# EAGLE design base-16-bit (EAGLE 9.4.0)
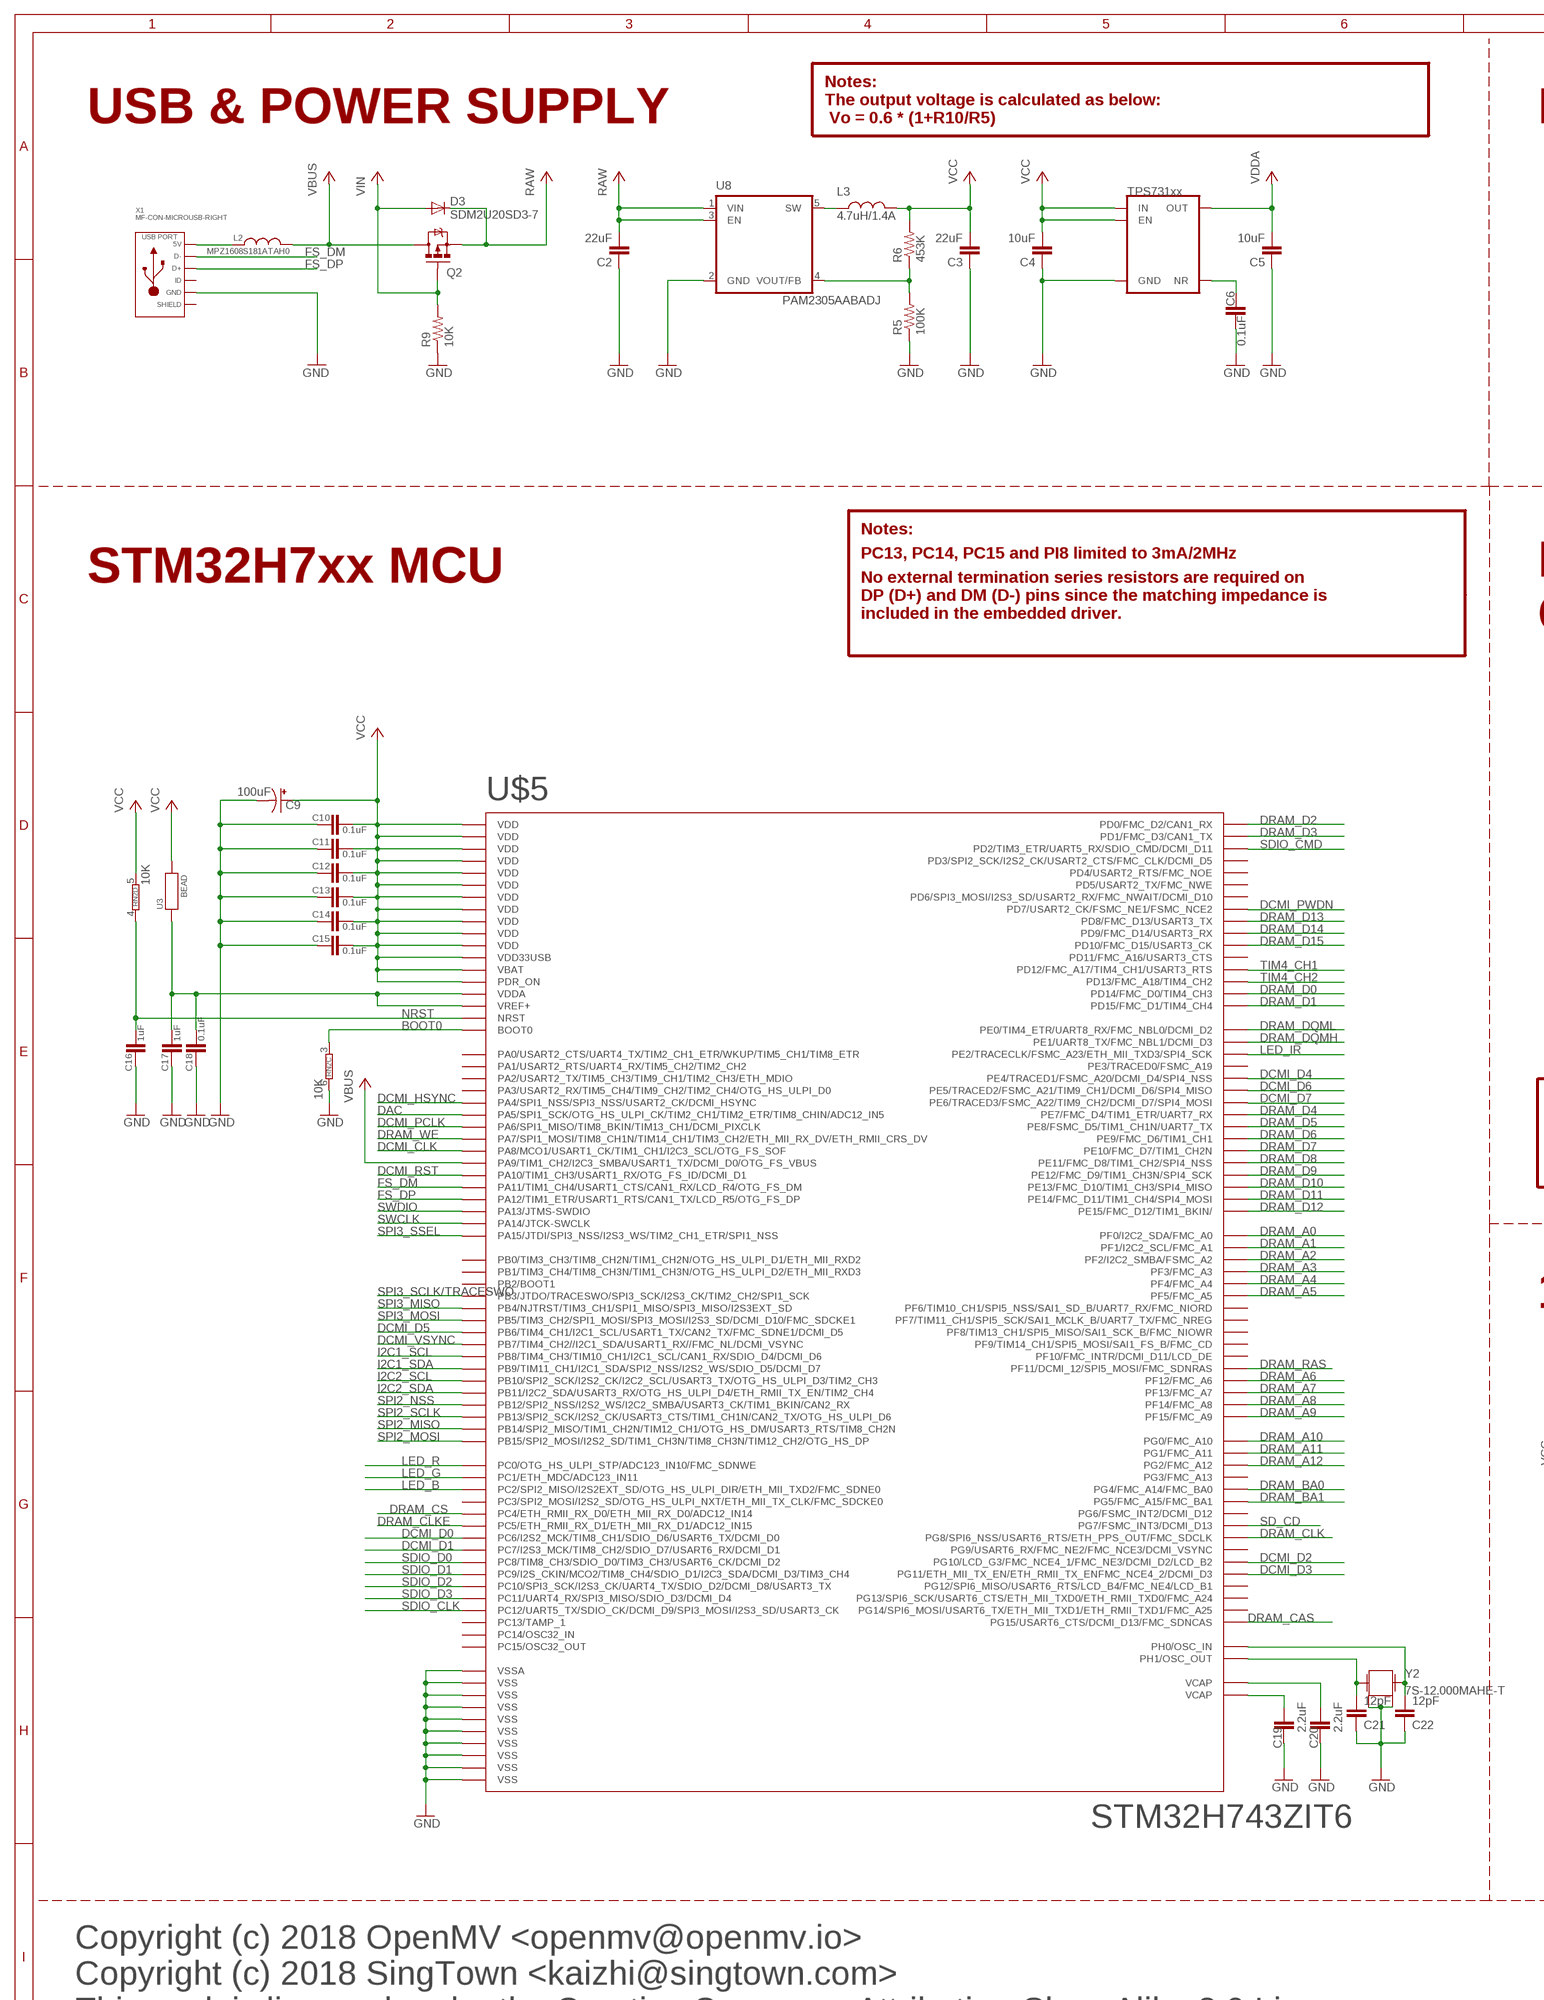
[diagram p0: schematic, sheet 1, part 1 of 2]
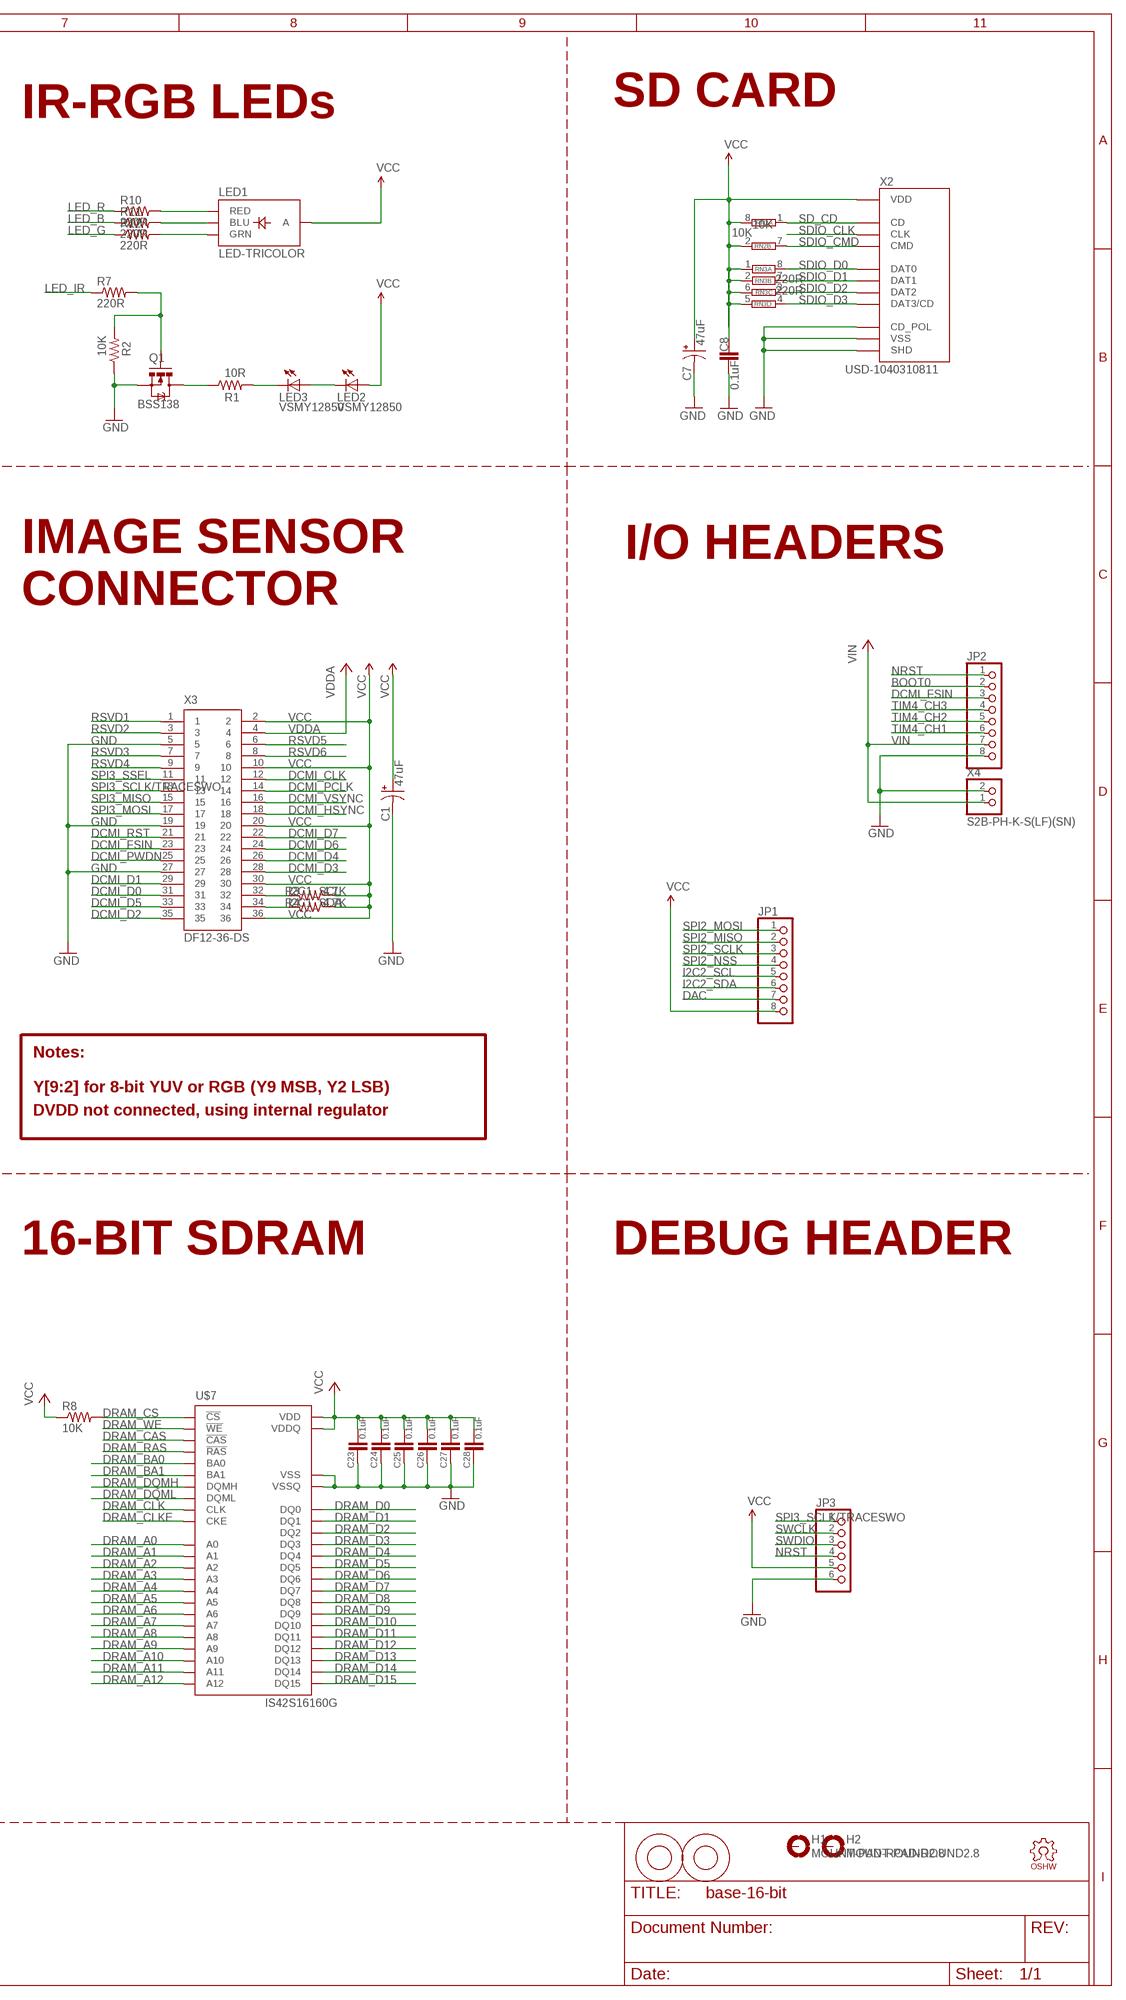
[diagram p1: schematic, sheet 1, part 2 of 2]

## Parts
C1  47uF  CAP_POL1206  [EIA3216]
C2  22uF  CAP0805  [0805]
C3  22uF  CAP0805  [0805]
C4  10uF  CAP0805  [0805]
C5  10uF  CAP0805  [0805]
C6  0.1uF  CAP0603-CAP  [0603-CAP]
C7  47uF  CAP_POL1206  [EIA3216]
C8  0.1uF  CAP0603-CAP  [0603-CAP]
C9  100uF  CAP_POL1206  [EIA3216]
C10  0.1uF  CAP0402-CAP  [0402-CAP]
C11  0.1uF  CAP0402-CAP  [0402-CAP]
C12  0.1uF  CAP0402-CAP  [0402-CAP]
C13  0.1uF  CAP0402-CAP  [0402-CAP]
C14  0.1uF  CAP0402-CAP  [0402-CAP]
C15  0.1uF  CAP0402-CAP  [0402-CAP]
C16  1uF  CAP0603-CAP  [0603-CAP]
C17  1uF  CAP0402-CAP  [0402-CAP]
C18  0.1uF  CAP0402-CAP  [0402-CAP]
C19  2.2uF  CAP0603-CAP  [0603-CAP]
C20  2.2uF  CAP0603-CAP  [0603-CAP]
C21  12pF  CAP0603-CAP  [0603-CAP]
C22  12pF  CAP0603-CAP  [0603-CAP]
C23  0.1uF  CAP0402-CAP  [0402-CAP]
C24  0.1uF  CAP0402-CAP  [0402-CAP]
C25  0.1uF  CAP0402-CAP  [0402-CAP]
C26  0.1uF  CAP0402-CAP  [0402-CAP]
C27  0.1uF  CAP0402-CAP  [0402-CAP]
C28  0.1uF  CAP0402-CAP  [0402-CAP]
D3  SDM2U20SD3-7  DIODESOD  [SOD-323]
H1  MOUNT-PAD-ROUND2.8  [2,8-PAD]
H2  MOUNT-PAD-ROUND2.8  [2,8-PAD]
JP1  PINHD-1X8  [1X08]
JP2  PINHD-1X8  [1X08]
JP3  PINHD-1X6  [1X06]
L2  MPZ1608S181ATAH0  INDUCTOR0603  [0603]
L3  4.7uH/1.4A  INDUCTOR1007  [1007]
LED1  LED-TRICOLOR  [LED-TRICOLOR-SMD]
LED2  VSMY12850  LED1206  [LED-1206]
LED3  VSMY12850  LED1206  [LED-1206]
LOGO1  OSHW_LOGO_FILLX0100-NT  [OSHW_FILLX100_NOTEXT]
M1  9774030243R  9774030151R  [9774030151R]
M2  9774030243R  9774030151R  [9774030151R]
Q1  BSS138  MOSFET-NCHANNELSMD  [SOT23-3]
Q2  Si2301BDS  MOSFET-PCHANNELSMD  [SOT23-3]
R1  10R  RESISTOR0603-RES  [0603-RES]
R2  10K  RESISTOR0603-RES  [0603-RES]
R3  4.7K  RESISTOR0603-RES  [0603-RES]
R4  4.7K  RESISTOR0603-RES  [0603-RES]
R5  100K  RESISTOR0603-RES  [0603-RES]
R6  453K  RESISTOR0603-RES  [0603-RES]
R7  220R  RESISTOR0402-RES  [0402-RES]
R8  10K  RESISTOR0402-RES  [0402-RES]
R9  10K  RESISTOR0603-RES  [0603-RES]
R10  220R  RESISTOR0402-RES  [0402-RES]
R11  220R  RESISTOR0402-RES  [0402-RES]
R12  220R  RESISTOR0402-RES  [0402-RES]
RN2  10K  4R-NEXBV8V  [EXBV8V]
RN3  220R  4R-NEXBV8V  [EXBV8V]
U3  BEAD  [0402-CAP]
U5  TPS731XX  [SOT23-5]
U8  PAM2305AABADJ  PAM2305AAB330  [TSOT25]
U$5  STM32H743ZIT6  [LQFP144@1]
U$7  IS42S16160G  [TSOPII-54]
X1  MF-CON-MICROUSB-RIGHT  USB_MICRO_RIGHT  [MICROUSB-RIGHT]
X2  USD-1040310811  [1040310811]
X3  DF12-36-DS  [DF12-36-DS]
X4  S2B-PH-K-S(LF)(SN)  JST_2PIN-THM-RA  [JST-PH-2-THM-RA]
Y2  7S-12.000MAHE-T  CRYSTAL2.5X2.0  [CRYSTAL-2.5X2.0]

## Nets
BOOT0: JP2.2 RN2.3 U$5.138(BOOT0)
DAC: JP1.7 U$5.41(PA5/SPI1_SCK/OTG_HS_ULPI_CK/TIM2_CH1/TIM2_ETR/TIM8_CHIN/ADC12_IN5)
DCMI_CLK: U$5.100(PA8/MCO1/USART1_CK/TIM1_CH1/I2C3_SCL/OTG_FS_SOF) X3.12
DCMI_D0: U$5.96(PC6/I2S2_MCK/TIM8_CH1/SDIO_D6/USART6_TX/DCMI_D0) X3.31
DCMI_D1: U$5.97(PC7/I2S3_MCK/TIM8_CH2/SDIO_D7/USART6_RX/DCMI_D1) X3.29
DCMI_D2: U$5.125(PG10/LCD_G3/FMC_NCE4_1/FMC_NE3/DCMI_D2/LCD_B2) X3.35
DCMI_D3: U$5.126(PG11/ETH_MII_TX_EN/ETH_RMII_TX_ENFMC_NCE4_2/DCMI_D3) X3.28
DCMI_D4: U$5.3(PE4/TRACED1/FSMC_A20/DCMI_D4/SPI4_NSS) X3.26
DCMI_D5: U$5.136(PB6/TIM4_CH1/I2C1_SCL/USART1_TX/CAN2_TX/FMC_SDNE1/DCMI_D5) X3.33
DCMI_D6: U$5.4(PE5/TRACED2/FSMC_A21/TIM9_CH1/DCMI_D6/SPI4_MISO) X3.24
DCMI_D7: U$5.5(PE6/TRACED3/FSMC_A22/TIM9_CH2/DCMI_D7/SPI4_MOSI) X3.22
DCMI_FSIN: JP2.3 X3.23
DCMI_HSYNC: U$5.40(PA4/SPI1_NSS/SPI3_NSS/USART2_CK/DCMI_HSYNC) X3.18
DCMI_PCLK: U$5.42(PA6/SPI1_MISO/TIM8_BKIN/TIM13_CH1/DCMI_PIXCLK) X3.14
DCMI_PWDN: U$5.123(PD7/USART2_CK/FSMC_NE1/FSMC_NCE2) X3.25
DCMI_RST: U$5.102(PA10/TIM1_CH3/USART1_RX/OTG_FS_ID/DCMI_D1) X3.21
DCMI_VSYNC: U$5.137(PB7/TIM4_CH2//I2C1_SDA/USART1_RX//FMC_NL/DCMI_VSYNC) X3.16
DRAM_A0: U$5.10(PF0/I2C2_SDA/FMC_A0) U$7.23(A0)
DRAM_A1: U$5.11(PF1/I2C2_SCL/FMC_A1) U$7.24(A1)
DRAM_A2: U$5.12(PF2/I2C2_SMBA/FSMC_A2) U$7.25(A2)
DRAM_A3: U$5.13(PF3/FMC_A3) U$7.26(A3)
DRAM_A4: U$5.14(PF4/FMC_A4) U$7.29(A4)
DRAM_A5: U$5.15(PF5/FMC_A5) U$7.30(A5)
DRAM_A6: U$5.50(PF12/FMC_A6) U$7.31(A6)
DRAM_A7: U$5.53(PF13/FMC_A7) U$7.32(A7)
DRAM_A8: U$5.54(PF14/FMC_A8) U$7.33(A8)
DRAM_A9: U$5.55(PF15/FMC_A9) U$7.34(A9)
DRAM_A10: U$5.56(PG0/FMC_A10) U$7.22(A10)
DRAM_A11: U$5.57(PG1/FMC_A11) U$7.35(A11)
DRAM_A12: U$5.87(PG2/FMC_A12) U$7.36(A12)
DRAM_BA0: U$5.89(PG4/FMC_A14/FMC_BA0) U$7.20(BA0)
DRAM_BA1: U$5.90(PG5/FMC_A15/FMC_BA1) U$7.21(BA1)
DRAM_CAS: U$5.132(PG15/USART6_CTS/DCMI_D13/FMC_SDNCAS) U$7.17(!CAS)
DRAM_CLK: U$5.93(PG8/SPI6_NSS/USART6_RTS/ETH_PPS_OUT/FMC_SDCLK) U$7.38(CLK)
DRAM_CLKE: U$5.45(PC5/ETH_RMII_RX_D1/ETH_MII_RX_D1/ADC12_IN15) U$7.37(CKE)
DRAM_CS: R8.2 U$5.44(PC4/ETH_RMII_RX_D0/ETH_MII_RX_D0/ADC12_IN14) U$7.19(!CS)
DRAM_D0: U$5.85(PD14/FMC_D0/TIM4_CH3) U$7.2(DQ0)
DRAM_D1: U$5.86(PD15/FMC_D1/TIM4_CH4) U$7.4(DQ1)
DRAM_D2: U$5.114(PD0/FMC_D2/CAN1_RX) U$7.5(DQ2)
DRAM_D3: U$5.115(PD1/FMC_D3/CAN1_TX) U$7.7(DQ3)
DRAM_D4: U$5.58(PE7/FMC_D4/TIM1_ETR/UART7_RX) U$7.8(DQ4)
DRAM_D5: U$5.59(PE8/FSMC_D5/TIM1_CH1N/UART7_TX) U$7.10(DQ5)
DRAM_D6: U$5.60(PE9/FMC_D6/TIM1_CH1) U$7.11(DQ6)
DRAM_D7: U$5.63(PE10/FMC_D7/TIM1_CH2N) U$7.13(DQ7)
DRAM_D8: U$5.64(PE11/FMC_D8/TIM1_CH2/SPI4_NSS) U$7.42(DQ8)
DRAM_D9: U$5.65(PE12/FMC_D9/TIM1_CH3N/SPI4_SCK) U$7.44(DQ9)
DRAM_D10: U$5.66(PE13/FMC_D10/TIM1_CH3/SPI4_MISO) U$7.45(DQ10)
DRAM_D11: U$5.67(PE14/FMC_D11/TIM1_CH4/SPI4_MOSI) U$7.47(DQ11)
DRAM_D12: U$5.68(PE15/FMC_D12/TIM1_BKIN/) U$7.48(DQ12)
DRAM_D13: U$5.77(PD8/FMC_D13/USART3_TX) U$7.50(DQ13)
DRAM_D14: U$5.78(PD9/FMC_D14/USART3_RX) U$7.51(DQ14)
DRAM_D15: U$5.79(PD10/FMC_D15/USART3_CK) U$7.53(DQ15)
DRAM_DQMH: U$5.142(PE1/UART8_TX/FMC_NBL1/DCMI_D3) U$7.39(DQMH)
DRAM_DQML: U$5.141(PE0/TIM4_ETR/UART8_RX/FMC_NBL0/DCMI_D2) U$7.15(DQML)
DRAM_RAS: U$5.49(PF11/DCMI_12/SPI5_MOSI/FMC_SDNRAS) U$7.18(!RAS)
DRAM_WE: U$5.43(PA7/SPI1_MOSI/TIM8_CH1N/TIM14_CH1/TIM3_CH2/ETH_MII_RX_DV/ETH_RMII_CRS_DV) U$7.16(!WE)
FS_DM: U$5.103(PA11/TIM1_CH4/USART1_CTS/CAN1_RX/LCD_R4/OTG_FS_DM) X1.2(D-)
FS_DP: U$5.104(PA12/TIM1_ETR/USART1_RTS/CAN1_TX/LCD_R5/OTG_FS_DP) X1.3(D+)
GND: C1.C(-) C2.1 C3.1 C4.1 C5.1 C6.2 C7.C(-) C8.2 C9.C(-) C10.2 C11.2 C12.2 C13.2 C14.2 C15.2 C16.2 C17.2 C18.2 C19.2 C20.2 C21.1 C22.1 C23.2 C24.2 C25.2 C26.2 C27.2 C28.2 JP2.8 JP3.6 Q1.2(S) R2.1 R5.1 R9.1 RN2.6 U5.2(GND) U8.2(GND) U$5.16(VSS) U$5.31(VSSA) U$5.38(VSS) U$5.51(VSS) U$5.61(VSS) U$5.83(VSS) U$5.94(VSS) U$5.107(VSS) U$5.120(VSS) U$5.130(VSS) U$7.6(VSSQ) U$7.12(VSSQ) U$7.28(VSS) U$7.41(VSS) U$7.46(VSSQ) U$7.52(VSSQ) U$7.54(VSS) X1.5(GND) X2.CD$2(CD_POL) X2.G$1(SHD) X2.G$2(SHD) X2.G$3(SHD) X2.G$4(SHD) X2.P$6(VSS) X3.5 X3.19 X3.27 X4.2 Y2.2 Y2.4
I2C1_SCL: R3.2 U$5.139(PB8/TIM4_CH3/TIM10_CH1/I2C1_SCL/CAN1_RX/SDIO_D4/DCMI_D6) X3.32
I2C1_SDA: R4.2 U$5.140(PB9/TIM11_CH1/I2C1_SDA/SPI2_NSS/I2S2_WS/SDIO_D5/DCMI_D7) X3.34
I2C2_SCL: JP1.5 U$5.69(PB10/SPI2_SCK/I2S2_CK/I2C2_SCL/USART3_TX/OTG_HS_ULPI_D3/TIM2_CH3)
I2C2_SDA: JP1.6 U$5.70(PB11/I2C2_SDA/USART3_RX/OTG_HS_ULPI_D4/ETH_RMII_TX_EN/TIM2_CH4)
LED_B: R11.1 U$5.28(PC2/SPI2_MISO/I2S2EXT_SD/OTG_HS_ULPI_DIR/ETH_MII_TXD2/FMC_SDNE0)
LED_G: R12.1 U$5.27(PC1/ETH_MDC/ADC123_IN11)
LED_IR: R7.1 U$5.1(PE2/TRACECLK/FSMC_A23/ETH_MII_TXD3/SPI4_SCK)
LED_R: R10.1 U$5.26(PC0/OTG_HS_ULPI_STP/ADC123_IN10/FMC_SDNWE)
N$5: Q1.1(G) R2.2 R7.2
N$6: LED1.B(BLU) R11.2
N$7: L2.1 X1.1(5V)
N$8: LED1.R(RED) R10.2
N$9: LED1.G(GRN) R12.2
N$10: LED3.C R1.2
N$11: C6.1 U5.4(NR)
N$13: R5.2 R6.1 U8.4(VOUT/FB)
N$14: Q1.3(D) R1.1
N$17: LED2.C LED3.A
N$30: C21.2 U$5.24(PH1/OSC_OUT) Y2.3
N$31: C22.2 U$5.23(PH0/OSC_IN) Y2.1
N$35: C17.1 C18.1 U3.1 U$5.32(VREF+) U$5.33(VDDA)
NRST: C16.1 JP2.1 JP3.4 RN2.4 U$5.25(NRST)
RAW: C2.2 D3.1(C) Q2.2(S) U8.1(VIN) U8.3(EN)
RSVD1: X3.1
RSVD2: X3.3
RSVD3: X3.7
RSVD4: X3.9
RSVD5: X3.6
RSVD6: X3.8
SD_CD: RN2.1 U$5.92(PG7/FSMC_INT3/DCMI_D13) X2.CD$1(CD)
SDIO_CLK: U$5.113(PC12/UART5_TX/SDIO_CK/DCMI_D9/SPI3_MOSI/I2S3_SD/USART3_CK) X2.P$5(CLK)
SDIO_CMD: RN2.7 U$5.116(PD2/TIM3_ETR/UART5_RX/SDIO_CMD/DCMI_D11) X2.P$3(CMD)
SDIO_D0: RN3.8 U$5.98(PC8/TIM8_CH3/SDIO_D0/TIM3_CH3/USART6_CK/DCMI_D2) X2.P$7(DAT0)
SDIO_D1: RN3.7 U$5.99(PC9/I2S_CKIN/MCO2/TIM8_CH4/SDIO_D1/I2C3_SDA/DCMI_D3/TIM3_CH4) X2.P$8(DAT1)
SDIO_D2: RN3.3 U$5.111(PC10/SPI3_SCK/I2S3_CK/UART4_TX/SDIO_D2/DCMI_D8/USART3_TX) X2.P$1(DAT2)
SDIO_D3: RN3.4 U$5.112(PC11/UART4_RX/SPI3_MISO/SDIO_D3/DCMI_D4) X2.P$2(DAT3/CD)
SPI2_MISO: JP1.2 U$5.75(PB14/SPI2_MISO/TIM1_CH2N/TIM12_CH1/OTG_HS_DM/USART3_RTS/TIM8_CH2N)
SPI2_MOSI: JP1.1 U$5.76(PB15/SPI2_MOSI/I2S2_SD/TIM1_CH3N/TIM8_CH3N/TIM12_CH2/OTG_HS_DP)
SPI2_NSS: JP1.4 U$5.73(PB12/SPI2_NSS/I2S2_WS/I2C2_SMBA/USART3_CK/TIM1_BKIN/CAN2_RX)
SPI2_SCLK: JP1.3 U$5.74(PB13/SPI2_SCK/I2S2_CK/USART3_CTS/TIM1_CH1N/CAN2_TX/OTG_HS_ULPI_D6)
SPI3_MISO: U$5.134(PB4/NJTRST/TIM3_CH1/SPI1_MISO/SPI3_MISO/I2S3EXT_SD) X3.15
SPI3_MOSI: U$5.135(PB5/TIM3_CH2/SPI1_MOSI/SPI3_MOSI/I2S3_SD/DCMI_D10/FMC_SDCKE1) X3.17
SPI3_SCLK/TRACESWO: JP3.1 U$5.133(PB3/JTDO/TRACESWO/SPI3_SCK/I2S3_CK/TIM2_CH2/SPI1_SCK) X3.13
SPI3_SSEL: U$5.110(PA15/JTDI/SPI3_NSS/I2S3_WS/TIM2_CH1_ETR/SPI1_NSS) X3.11
SW: L3.1 U8.5(SW)
SWCLK: JP3.2 U$5.109(PA14/JTCK-SWCLK)
SWDIO: JP3.3 U$5.105(PA13/JTMS-SWDIO)
TIM4_CH1: JP2.6 U$5.81(PD12/FMC_A17/TIM4_CH1/USART3_RTS)
TIM4_CH2: JP2.5 U$5.82(PD13/FMC_A18/TIM4_CH2)
TIM4_CH3: JP2.4
VBUS: L2.2 Q2.3(D) U$5.101(PA9/TIM1_CH2/I2C3_SMBA/USART1_TX/DCMI_D0/OTG_FS_VBUS)
VCAP1: C19.1 U$5.106(VCAP)
VCAP2: C20.1 U$5.71(VCAP)
VCC: C1.A(+) C3.2 C4.2 C7.A(+) C8.1 C9.A(+) C10.1 C11.1 C12.1 C13.1 C14.1 C15.1 C23.1 C24.1 C25.1 C26.1 C27.1 C28.1 JP1.8 JP3.5 L3.2 LED1.A LED2.A R3.1 R4.1 R6.2 R8.1 RN2.2 RN2.5 RN2.8 RN3.1 RN3.2 RN3.5 RN3.6 U3.2 U5.1(IN) U5.3(EN) U$5.6(VBAT) U$5.17(VDD) U$5.30(VDD) U$5.39(VDD) U$5.52(VDD) U$5.62(VDD) U$5.72(VDD) U$5.84(VDD) U$5.95(VDD33USB) U$5.108(VDD) U$5.121(VDD) U$5.131(VDD) U$5.143(PDR_ON) U$5.144(VDD) U$7.1(VDD) U$7.3(VDDQ) U$7.9(VDDQ) U$7.14(VDD) U$7.27(VDD) U$7.43(VDDQ) U$7.49(VDDQ) X2.P$4(VDD) X3.2 X3.10 X3.20 X3.30 X3.36
VDDA: C5.2 U5.5(OUT) X3.4
VIN: D3.2(A) JP2.7 Q2.1(G) R9.2 X4.1
Unconnected: H1.B2,8(MOUNT) H2.B2,8(MOUNT) U$5.2(PE3/TRACED0/FSMC_A19) U$5.7(PC13/TAMP_1) U$5.8(PC14/OSC32_IN) U$5.9(PC15/OSC32_OUT) U$5.18(PF6/TIM10_CH1/SPI5_NSS/SAI1_SD_B/UART7_RX/FMC_NIORD) U$5.19(PF7/TIM11_CH1/SPI5_SCK/SAI1_MCLK_B/UART7_TX/FMC_NREG) U$5.20(PF8/TIM13_CH1/SPI5_MISO/SAI1_SCK_B/FMC_NIOWR) U$5.21(PF9/TIM14_CH1/SPI5_MOSI/SAI1_FS_B/FMC_CD) U$5.22(PF10/FMC_INTR/DCMI_D11/LCD_DE) U$5.29(PC3/SPI2_MOSI/I2S2_SD/OTG_HS_ULPI_NXT/ETH_MII_TX_CLK/FMC_SDCKE0) U$5.34(PA0/USART2_CTS/UART4_TX/TIM2_CH1_ETR/WKUP/TIM5_CH1/TIM8_ETR) U$5.35(PA1/USART2_RTS/UART4_RX/TIM5_CH2/TIM2_CH2) U$5.36(PA2/USART2_TX/TIM5_CH3/TIM9_CH1/TIM2_CH3/ETH_MDIO) U$5.37(PA3/USART2_RX/TIM5_CH4/TIM9_CH2/TIM2_CH4/OTG_HS_ULPI_D0) U$5.46(PB0/TIM3_CH3/TIM8_CH2N/TIM1_CH2N/OTG_HS_ULPI_D1/ETH_MII_RXD2) U$5.47(PB1/TIM3_CH4/TIM8_CH3N/TIM1_CH3N/OTG_HS_ULPI_D2/ETH_MII_RXD3) U$5.48(PB2/BOOT1) U$5.80(PD11/FMC_A16/USART3_CTS) U$5.88(PG3/FMC_A13) U$5.91(PG6/FSMC_INT2/DCMI_D12) U$5.117(PD3/SPI2_SCK/I2S2_CK/USART2_CTS/FMC_CLK/DCMI_D5) U$5.118(PD4/USART2_RTS/FMC_NOE) U$5.119(PD5/USART2_TX/FMC_NWE) U$5.122(PD6/SPI3_MOSI/I2S3_SD/USART2_RX/FMC_NWAIT/DCMI_D10) U$5.124(PG9/USART6_RX/FMC_NE2/FMC_NCE3/DCMI_VSYNC) U$5.127(PG12/SPI6_MISO/USART6_RTS/LCD_B4/FMC_NE4/LCD_B1) U$5.128(PG13/SPI6_SCK/USART6_CTS/ETH_MII_TXD0/ETH_RMII_TXD0/FMC_A24) U$5.129(PG14/SPI6_MOSI/USART6_TX/ETH_MII_TXD1/ETH_RMII_TXD1/FMC_A25) X1.4(ID) X1.S1(SLD) X1.S2(SLD) X1.S3(SLD) X1.S4(SLD) X1.S5(SLD) X1.S6(SLD)

## Notes on the sheet
- Notes:
- USB & POWER SUPPLY | SD CARD
- The output voltage is calculated as below:
   Vo = 0.6 * (1+R10/R5)
- IR-RGB LEDs
- Notes:
- PC13, PC14, PC15 and PI8 limited to 3mA/2MHz
- STM32H7xx MCU | I/O HEADERS
- No external termination series resistors are required on
  DP (D+) and DM (D-) pins since the matching impedance is
  included in the embedded driver.
- IMAGE SENSOR
  CONNECTOR
- Notes:
- Y[9:2] for 8-bit YUV or RGB (Y9 MSB, Y2 LSB)
- DVDD not connected, using internal regulator
- 16-BIT SDRAM | DEBUG HEADER
- Copyright (c) 2018 OpenMV <openmv@openmv.io>
  Copyright (c) 2018 SingTown <kaizhi@singtown.com>
- This work is licensed under the Creative Commons Attribution-ShareAlike 3.0 License.
- To view a copy of this license, visit http://creativecommons.org/licenses/by-sa/3.0/

## Library data of the parts
C1 C7 C9 = sfe:CAP_POL: Capacitor Polarized These are standard SMD and PTH capacitors. Normally 10uF, 47uF, and 100uF in electrolytic and tantalum varieties. Always verify the external diameter of the through hole cap, it varies with capacity, voltage, and manufacturer. The EIA devices should be standard.
C2-C6 C8 C10-C28 = sfe:CAP: Capacitor Standard 0603 ceramic capacitor, and 0.1" leaded capacitor.
D3 = sfe:DIODE: Diode These are standard reverse protection diodes and small signal diodes. SMA package can handle up to about 1A. SOD-323 can handle about 200mA. What the SOD-323 package when ordering, there are some mfgs out there that are 5-pin packages.
H1 H2 = holes:MOUNT-PAD-ROUND: MOUNTING PAD, round
JP1 JP2 = pinhead:PINHD-1X8: PIN HEADER
JP3 = pinhead:PINHD-1X6: PIN HEADER
L2 L3 = sfe:INDUCTOR: Inductors Basic Inductor/Choke - 0603 and 1206. Footprints are not proven and vary greatly between part numbers.
LED1 = sfe:LED-TRICOLOR: Tri-Color LED SMD Proven layout and schematic for triple color LED in SMD package - common anode. Spark Fun Electronics SKU : COM-07844
LED2 LED3 = sfe:LED: LEDs Standard schematic elements and footprints for 5mm, 3mm, 1206, and 0603 sized LEDs. 5mm - Spark Fun Electronics SKU : COM-00529 (and others)
LOGO1 = iofault:OSHW_LOGO_FILL
M1 M2 = STANDOFFS:9774030151R
Q1 = sfe:MOSFET-NCHANNEL
Q2 = sfe:MOSFET-PCHANNEL
R1-R12 = sfe:RESISTOR: Resistor Basic schematic elements and footprints for 0603, 1206, and PTH resistors.
RN2 RN3 = resistor-dil:4R-N: Array Chip Resistor Source: RS Component / Phycomp; OC_FARNELL: unknown; OC_NEWARK: unknown
U3 = heka:BEAD
U5 = mux:TPS731XX
U8 = regulators:PAM2305AAB330
U$5 = stm32:STM32H743ZIT6
U$7 = mux:IS42S16160G
X1 = MF_Connectors:USB: Library: MF_Connectors Description: 5 Pin USB Connectors. SLD is the shield connection. Usually tied to ground through a small ferrite bead.
X2 = molex:USD-1040310811
X3 = DF12:DF12-36-DS
X4 = adafruit-updated:JST_2PIN: JST 2-Pin Connectors of various flavors SMT-RA (S2B-PH-SM4) 4UConnector #17311 SMT (B2B-PH-SM4) THM-RA (S2B-PH) THM (B2B-PH)
Y2 = mux:CRYSTAL: Crystals Various standard crystals. Proven footprints. Spark Fun Electronics SKU : COM-00534

## Board
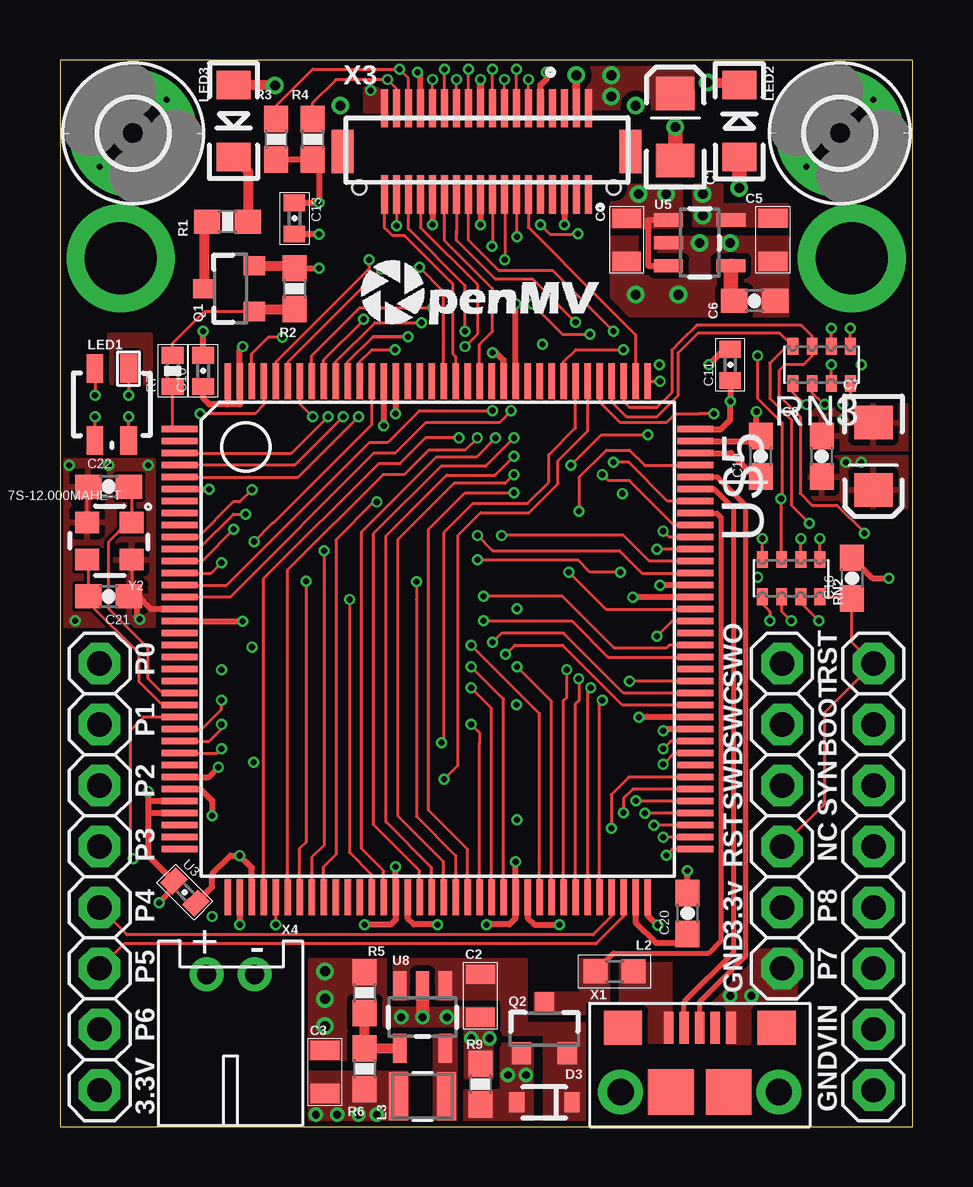
[diagram p2: board, top side]
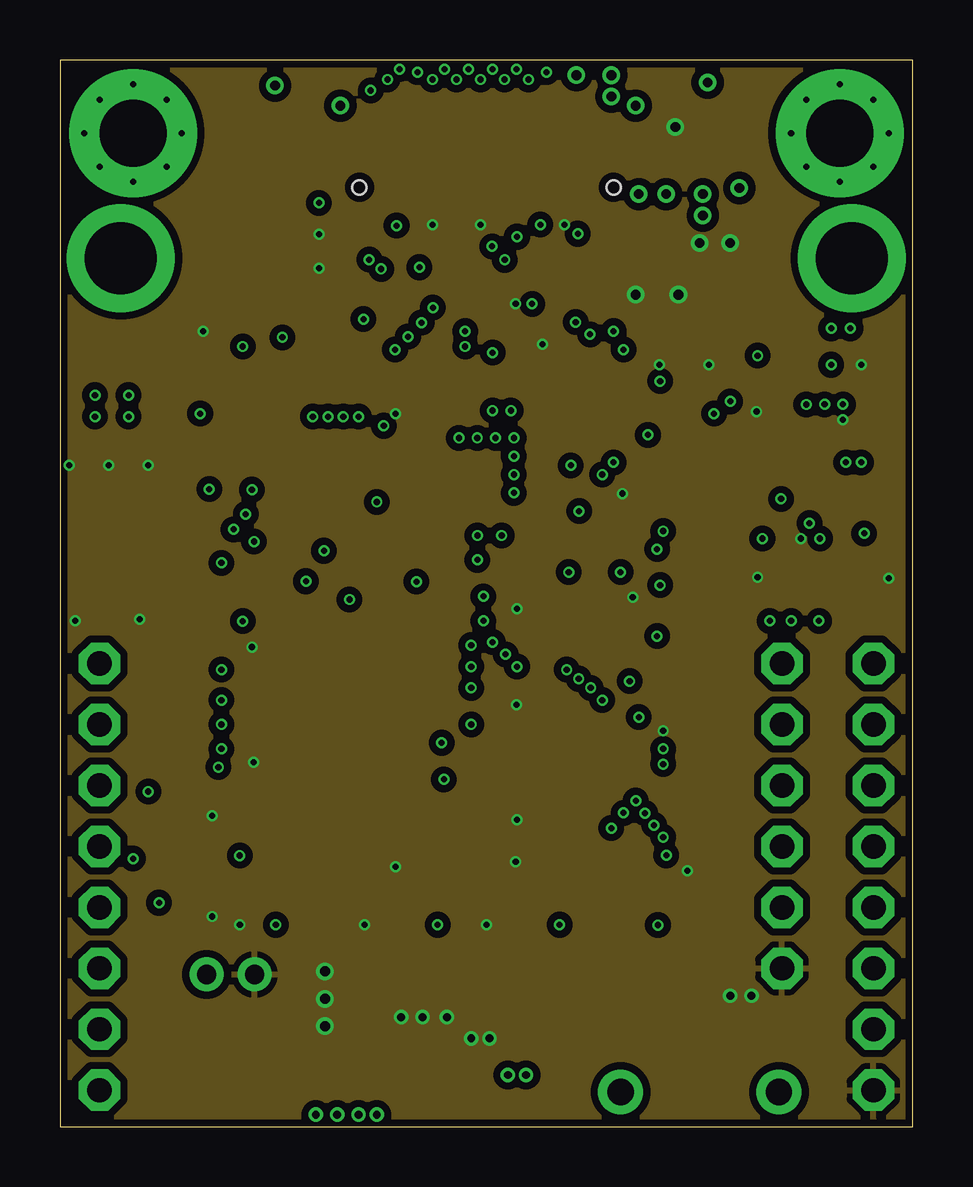
[diagram p3: board, inner layer GND]
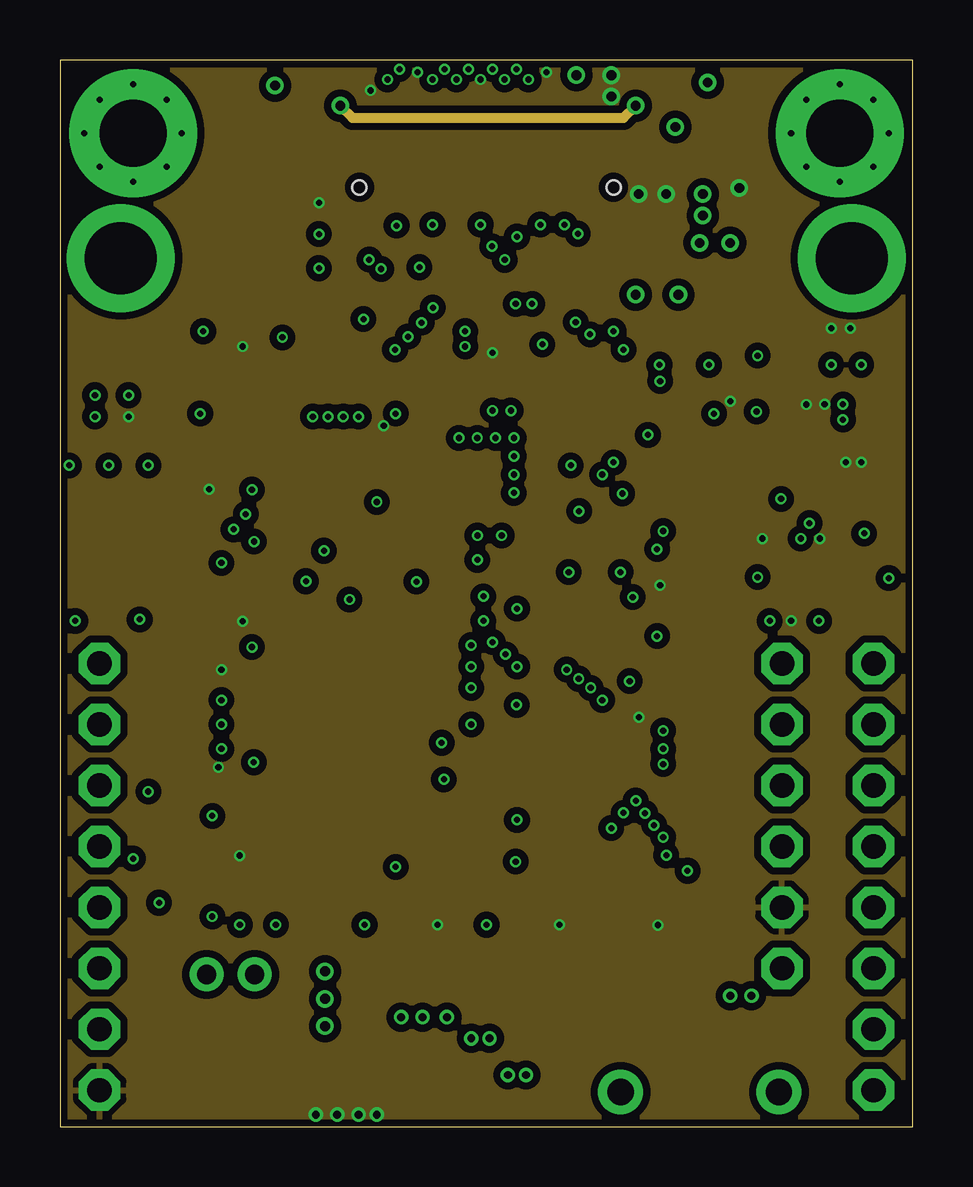
[diagram p4: board, inner layer VCC]
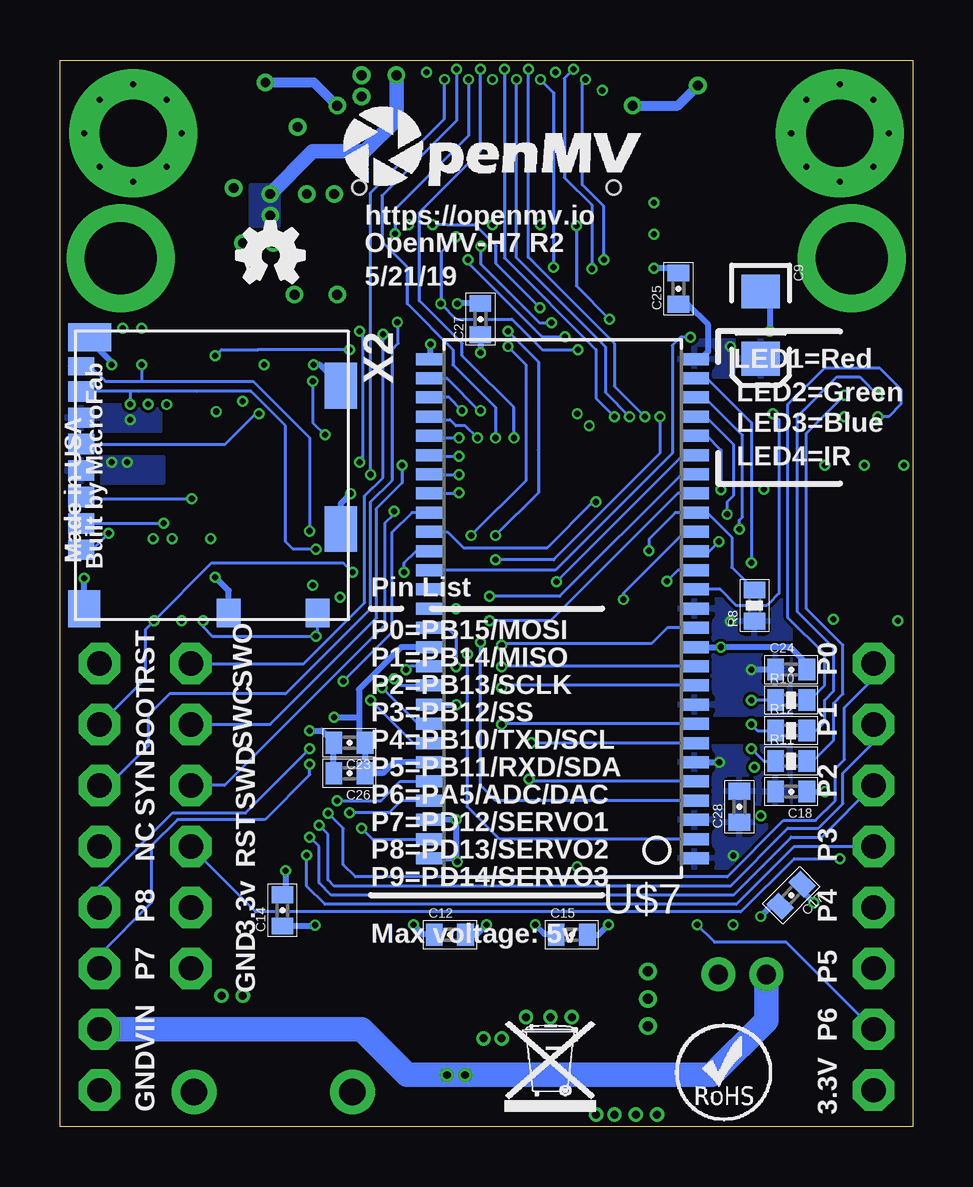
[diagram p5: board, bottom side, seen from below]

Size 35.56 x 44.45 mm. Coordinates in mm from the lower left corner, seen from the top.
Outline: 0,44.45 0,0 35.56,0 35.56,44.45 0,44.45
Copper layers (1*2+15*16): Top 0.035mm / dielectric 1.5mm / GND 0.035mm / dielectric 0.15mm / VCC 0.035mm / dielectric 0.2mm / Bottom 0.035mm
Design rules "default": minimum track width 5mil, minimum drill 10mil, track to track 5mil, track to pad 5mil, pad to pad 5mil, via to via 5mil, smd to smd 5mil, copper to edge 5mil, drill to drill 10mil, minimum pad ring 10mil, minimum via ring 4mil, stop-mask expansion 2mil, vias tented up to drill 30mil, thermal gap 10mil

### Footprints (pad centres in the part's own frame; a part is rotated, then mirrored left to right if it is on the bottom)
EIA3216 = smd 1.4 x 1.6: A 1.4,0; C -1.4,0
0805 = smd 0.8 x 1.2: 1 -0.9,0; 2 0.9,0
0603-CAP = smd 1.1 x 1: 1 -0.85,0; 2 0.85,0
0402-CAP = smd 0.7 x 0.9: 1 -0.65,0; 2 0.65,0
SOD-323 = smd 0.63 x 0.83: 1 -1.15,0; 2 1.15,0
2,8-PAD = drill 2.8 pad 5.334: B2,8 0,0
1X08 = drill 1.016 octagon: 1 -8.89,0; 2 -6.35,0; 3 -3.81,0; 4 -1.27,0; 5 1.27,0; 6 3.81,0; 7 6.35,0; 8 8.89,0
1X06 = drill 1.016 octagon: 1 -6.35,0; 2 -3.81,0; 3 -1.27,0; 4 1.27,0; 5 3.81,0; 6 6.35,0
0603 = smd 1 x 1: 1 -0.8,0; 2 0.8,0
1007 = smd 2 x 0.8: 1 0,1; 2 0,-1
LED-TRICOLOR-SMD = smd 0.7 x 1.2: A 0.7,-1.5; B 0.7,1.5; G -0.7,1.5; R -0.7,-1.5
LED-1206 = smd 1.2 x 1.4: A -1.5,0; C 1.5,0
9774030151R = drill 3 pad 4.5: P$1 0,0
SOT23-3 = smd 0.8 x 0.9: 1 -0.95,-1; 2 0.95,-1; 3 0,1.1
0603-RES = smd 1.1 x 1: 1 -0.85,0; 2 0.85,0
0402-RES = smd 0.7 x 0.9: 1 -0.65,0; 2 0.65,0
EXBV8V = smd 0.45 x 0.7: 1 -1.2,-0.775; 2 -0.4,-0.775; 3 0.4,-0.775; 4 1.2,-0.775; 5 1.2,0.775; 6 0.4,0.775; 7 -0.4,0.775; 8 -1.2,0.775
SOT23-5 = smd 0.55 x 1.2: 1 -0.95,-1.3; 2 0,-1.3; 3 0.95,-1.3; 4 0.95,1.3; 5 -0.95,1.3
TSOT25 = smd 0.55 x 1.2: 1 -0.95,-1.3; 2 0,-1.3; 3 0.95,-1.3; 4 0.95,1.3; 5 -0.95,1.3
LQFP144@1 = smd 0.27 x 1.5: 1 -8.75,-10.75; 2 -8.25,-10.75; 3 -7.75,-10.75; 4 -7.25,-10.75; 5 -6.75,-10.75; 6 -6.25,-10.75; 7 -5.75,-10.75; 8 -5.25,-10.75; 9 -4.75,-10.75; 10 -4.25,-10.75; 11 -3.75,-10.75; 12 -3.25,-10.75; 13 -2.75,-10.75; 14 -2.25,-10.75; 15 -1.75,-10.75; 16 -1.25,-10.75; 17 -0.75,-10.75; 18 -0.25,-10.75; 19 0.25,-10.75; 20 0.75,-10.75; 21 1.25,-10.75; 22 1.75,-10.75; 23 2.25,-10.75; 24 2.75,-10.75; 25 3.25,-10.75; 26 3.75,-10.75; 27 4.25,-10.75; 28 4.75,-10.75; 29 5.25,-10.75; 30 5.75,-10.75; 31 6.25,-10.75; 32 6.75,-10.75; 33 7.25,-10.75; 34 7.75,-10.75; 35 8.25,-10.75; 36 8.75,-10.75; 73 8.75,10.75; 74 8.25,10.75; 75 7.75,10.75; 76 7.25,10.75; 77 6.75,10.75; 78 6.25,10.75; 79 5.75,10.75; 80 5.25,10.75; 81 4.75,10.75; 82 4.25,10.75; 83 3.75,10.75; 84 3.25,10.75; 85 2.75,10.75; 86 2.25,10.75; 87 1.75,10.75; 88 1.25,10.75; 89 0.75,10.75; 90 0.25,10.75; 91 -0.25,10.75; 92 -0.75,10.75; 93 -1.25,10.75; 94 -1.75,10.75; 95 -2.25,10.75; 96 -2.75,10.75; 97 -3.25,10.75; 98 -3.75,10.75; 99 -4.25,10.75; 100 -4.75,10.75; 101 -5.25,10.75; 102 -5.75,10.75; 103 -6.25,10.75; 104 -6.75,10.75; 105 -7.25,10.75; 106 -7.75,10.75; 107 -8.25,10.75; 108 -8.75,10.75 | smd 1.5 x 0.27: 37 10.75,-8.75; 38 10.75,-8.25; 39 10.75,-7.75; 40 10.75,-7.25; 41 10.75,-6.75; 42 10.75,-6.25; 43 10.75,-5.75; 44 10.75,-5.25; 45 10.75,-4.75; 46 10.75,-4.25; 47 10.75,-3.75; 48 10.75,-3.25; 49 10.75,-2.75; 50 10.75,-2.25; 51 10.75,-1.75; 52 10.75,-1.25; 53 10.75,-0.75; 54 10.75,-0.25; 55 10.75,0.25; 56 10.75,0.75; 57 10.75,1.25; 58 10.75,1.75; 59 10.75,2.25; 60 10.75,2.75; 61 10.75,3.25; 62 10.75,3.75; 63 10.75,4.25; 64 10.75,4.75; 65 10.75,5.25; 66 10.75,5.75; 67 10.75,6.25; 68 10.75,6.75; 69 10.75,7.25; 70 10.75,7.75; 71 10.75,8.25; 72 10.75,8.75; 109 -10.75,8.75; 110 -10.75,8.25; 111 -10.75,7.75; 112 -10.75,7.25; 113 -10.75,6.75; 114 -10.75,6.25; 115 -10.75,5.75; 116 -10.75,5.25; 117 -10.75,4.75; 118 -10.75,4.25; 119 -10.75,3.75; 120 -10.75,3.25; 121 -10.75,2.75; 122 -10.75,2.25; 123 -10.75,1.75; 124 -10.75,1.25; 125 -10.75,0.75; 126 -10.75,0.25; 127 -10.75,-0.25; 128 -10.75,-0.75; 129 -10.75,-1.25; 130 -10.75,-1.75; 131 -10.75,-2.25; 132 -10.75,-2.75; 133 -10.75,-3.25; 134 -10.75,-3.75; 135 -10.75,-4.25; 136 -10.75,-4.75; 137 -10.75,-5.25; 138 -10.75,-5.75; 139 -10.75,-6.25; 140 -10.75,-6.75; 141 -10.75,-7.25; 142 -10.75,-7.75; 143 -10.75,-8.25; 144 -10.75,-8.75
TSOPII-54 = smd 0.5 x 1.2: 1 -10.4,-5.502; 2 -9.6,-5.502; 3 -8.8,-5.502; 4 -8,-5.502; 5 -7.2,-5.502; 6 -6.4,-5.502; 7 -5.6,-5.502; 8 -4.8,-5.502; 9 -4,-5.502; 10 -3.2,-5.502; 11 -2.4,-5.502; 12 -1.6,-5.502; 13 -0.8,-5.502; 14 0,-5.502; 15 0.8,-5.502; 16 1.6,-5.502; 17 2.4,-5.502; 18 3.2,-5.502; 19 4,-5.502; 20 4.8,-5.502; 21 5.6,-5.502; 22 6.4,-5.502; 23 7.2,-5.502; 24 8,-5.502; 25 8.8,-5.502; 26 9.6,-5.502; 27 10.4,-5.502; 28 10.4,5.502; 29 9.6,5.502; 30 8.8,5.502; 31 8,5.502; 32 7.2,5.502; 33 6.4,5.502; 34 5.6,5.502; 35 4.8,5.502; 36 4,5.502; 37 3.2,5.502; 38 2.4,5.502; 39 1.6,5.502; 40 0.8,5.502; 41 0,5.502; 42 -0.8,5.502; 43 -1.6,5.502; 44 -2.4,5.502; 45 -3.2,5.502; 46 -4,5.502; 47 -4.8,5.502; 48 -5.6,5.502; 49 -6.4,5.502; 50 -7.2,5.502; 51 -8,5.502; 52 -8.8,5.502; 53 -9.6,5.502; 54 -10.4,5.502
MICROUSB-RIGHT = smd 0.4 x 1.35: 1 -1.3,1.27; 2 -0.65,1.27; 3 0,1.27; 4 0.65,1.27; 5 1.3,1.27 | drill 1.1: S1 -3.3,-1.405; S2 3.3,-1.405 | smd 1.6 x 1.4: S3 -3.2,1.27; S4 3.2,1.27 | smd 1.9 x 1.9: S5 -1.2,-1.405; S6 1.2,-1.405
1040310811 = smd 1.2 x 1: CD$1 11.74,10.1; CD$2 11.74,6.4 | smd 1.55 x 1.35: G$1 11.565,0.375 | smd 1.17 x 1.8: G$2 0.245,0.6 | smd 1.9 x 1.35: G$3 2.27,11.075; G$4 8.24,11.075 | smd 0.85 x 1.1: P$1 9.105,0.25; P$2 8.005,0.25; P$3 6.905,0.25; P$4 5.805,0.25; P$5 4.705,0.25; P$6 3.605,0.25; P$7 2.505,0.25 | smd 0.75 x 1.1: P$8 1.455,0.25
DF12-36-DS = smd 0.3 x 1.6: 1 4.25,-1.8; 2 4.25,1.8; 3 3.75,-1.8; 4 3.75,1.8; 5 3.25,-1.8; 6 3.25,1.8; 7 2.75,-1.8; 8 2.75,1.8; 9 2.25,-1.8; 10 2.25,1.8; 11 1.75,-1.8; 12 1.75,1.8; 13 1.25,-1.8; 14 1.25,1.8; 15 0.75,-1.8; 16 0.75,1.8; 17 0.25,-1.8; 18 0.25,1.8; 19 -0.25,-1.8; 20 -0.25,1.8; 21 -0.75,-1.8; 22 -0.75,1.8; 23 -1.25,-1.8; 24 -1.25,1.8; 25 -1.75,-1.8; 26 -1.75,1.8; 27 -2.25,-1.8; 28 -2.25,1.8; 29 -2.75,-1.8; 30 -2.75,1.8; 31 -3.25,-1.8; 32 -3.25,1.8; 33 -3.75,-1.8; 34 -3.75,1.8; 35 -4.25,-1.8; 36 -4.25,1.8 | smd 0.9 x 1.8: F1 6,0; F2 -6,0 | hole 0.6: 5.3,-1.5; -5.3,-1.5
JST-PH-2-THM-RA = drill 0.8 pad 1.422: 1 1,0; 2 -1,0
CRYSTAL-2.5X2.0 = smd 1 x 0.9: 1 -0.95,-0.8; 2 0.9,-0.8; 3 0.9,0.75; 4 -0.95,0.75

### Placement (x,y rotation side)
C1  25.65,41.66 90 top
C2  17.53,5.46 90 top
C3  11.05,2.29 270 top
C4  23.62,36.96 90 top
C5  29.72,36.96 90 top
C6  28.96,34.42 0 top
C7  33.91,27.94 270 top
C8  31.75,27.94 90 top
C9  6.35,33.4 270 bottom
C10  5.97,31.5 90 top
C11  27.94,31.75 90 top
C12  19.3,8 0 bottom
C13  9.78,37.85 270 top
C14  26.29,9.02 90 bottom
C15  14.22,8 0 bottom
C16  33.02,22.86 90 top
C17  5.08,9.65 225 bottom
C18  5.08,13.97 180 bottom
C19  29.21,27.94 90 top
C20  26.16,8.89 90 top
C21  2.03,22.1 180 top
C22  2.03,26.67 0 top
C23  23.5,16 180 bottom
C24  5.08,19.05 0 bottom
C25  9.78,34.92 90 bottom
C26  23.5,14.73 180 bottom
C27  18.03,33.66 90 bottom
C28  7.24,13.34 90 bottom
D3  20.19,1.02 180 top
H1  3.05,41.4 90 top
H2  32.51,41.4 270 top
JP1  1.65,10.41 270 top
JP2  33.91,10.41 270 top
JP3  30.1,12.95 270 top
L2  23.11,6.48 180 top
L3  15.11,1.27 270 top
LED1  2.16,30.1 0 top
LED2  28.32,41.91 90 top
LED3  7.24,41.91 270 top
LOGO1  28.19,35.18 0 bottom
M1  2.54,36.2 0 top
M2  33.02,36.2 0 top
Q1  7.11,34.92 90 top
Q2  20.19,4.06 0 top
R1  6.99,37.72 0 top
R2  9.78,34.92 270 top
R3  9.02,41.15 90 top
R4  10.54,41.15 90 top
R5  12.7,5.59 270 top
R6  12.7,2.41 270 top
R7  4.7,31.5 90 top
R8  6.6,21.72 90 bottom
R9  17.53,1.78 270 top
R10  5.08,17.78 0 bottom
R11  5.08,15.24 0 bottom
R12  5.08,16.51 0 bottom
RN2  30.48,22.86 0 top
RN3  31.75,31.75 180 top
U3  5.21,9.78 315 top
U5  26.67,36.83 270 top
U8  15.11,4.57 180 top
U$1  [WEEE]  17.02,0.64 0 bottom
U$2  [ROHS]  9.91,0.25 0 bottom
U$3  [OMV-LOGO]  23.88,38.99 0 bottom
U$4  [OMV-LOGO-SMALL]  12.45,33.27 0 top
U$5  15.75,20.32 270 top
U$7  14.61,21.59 90 bottom
X1  26.67,2.86 0 top
X2  34.92,33.15 270 bottom
X3  17.78,40.64 0 top
X4  7.11,6.35 180 top
Y2  2.03,24.38 180 top

### Tracks (layer width: path | path; a pad name or v marks a point on that pad's centre or on a via)
BOOT0  (via drill 0.25)
  Top 0.127: U$5.138 10,30.13 v10.54,29.59 | v17.4,23.62 21.59,23.62 22.1,23.11 v23.37,23.11 | v31.64,21.08 v31.63,21.08 30.88,21.83 RN2.3
  Bottom 0.127: v10.54,29.59 10.54,28.07 14.99,23.62 v17.4,23.62 | JP2.2 32,18.67 32,20.72 v31.64,21.08 29.23,23.5 27.81,23.5 23.75,23.5 v23.37,23.11
DAC  (via drill 0.25)
  Top 0.127: U$5.41 v9,8.42
  Bottom 0.127: JP1.7 5.27,7.68 8.26,7.68 v9,8.42
DCMI_CLK  (via drill 0.25)
  Top 0.127: X3.12 v19.53,43.64 | U$5.100 25.6,25.07 23.75,26.92 22.86,26.92 v22.61,27.18
  Bottom 0.127: v19.53,43.64 19.53,42 22.61,38.92 22.61,35.05 v22.61,27.18
DCMI_D0  (via drill 0.25)
  Top 0.127: X3.31 14.53,37.41 16.89,35.05 v16.89,33.15 | U$5.96 24.26,23.07 23.32,24 18.03,24 v17.4,24.64
  Bottom 0.127: v16.89,33.15 15.62,31.88 15.62,28.19 15.62,26.42 v17.4,24.64
DCMI_D1  (via drill 0.25)
  Top 0.127: X3.29 15.03,37.47 17.4,35.1 17.4,33.02 v16.89,32.51 | U$5.97 24.56,23.57 23.5,24.64 v18.41,24.64
  Bottom 0.127: v16.89,32.51 16.13,31.75 16.13,26.92 v18.41,24.64
DCMI_D2
  Top 0.127: U$5.125 16.5,32.09 16.37,32.21 16.37,35.13 16.29,35.21 14.37,37.13 13.86,37.13 13.53,37.45 X3.35
DCMI_D3  (via drill 0.25)
  Top 0.127: X3.28 v15.53,43.64 | U$5.126 16,32.89 16,34.8 v14.99,35.81
  Bottom 0.127: v14.99,35.81 14.99,36.32 14.99,43.09 v15.53,43.64
DCMI_D4  (via drill 0.25)
  Top 0.127: X3.26 v16.03,44.07 | U$5.3 9.65,28.07 v11.18,29.59
  Bottom 0.127: v11.18,29.59 12.45,30.86 12.45,32.64 16.03,36.22 v16.03,44.07
DCMI_D5  (via drill 0.25)
  Top 0.127: U$5.136 11,31.96 12.65,33.61 v12.65,33.66 | X3.33 v14.03,37.55
  Bottom 0.127: v14.03,37.55 14.03,35.04 v12.65,33.66
DCMI_D6  (via drill 0.25)
  Top 0.127: X3.24 v16.53,43.64 | v11.81,29.59 9.79,27.57 U$5.4
  Bottom 0.127: v11.81,29.59 12.83,30.61 12.83,32.51 16.53,36.22 v16.53,43.64
DCMI_D7  (via drill 0.25)
  Top 0.127: X3.22 v17.03,44.07 | U$5.5 9.93,27.07 v12.45,29.59
  Bottom 0.127: v17.03,44.07 17.03,36.21 13.21,32.38 13.21,30.35 v12.45,29.59
DCMI_FSIN  (via drill 0.25)
  Top 0.127: X3.23 16.53,37.34 | 16.53,37.34 16.53,37.21 16.53,37.19 | v21.5,33.53 19.72,35.31 18.16,35.31 17.46,36.01 16.53,36.94 16.53,37.19 | 16.53,37.19 16.53,37.34
  Bottom 0.127: v21.5,33.53 21.46,33.49 21.46,32.64 21.72,32.38 21.72,26.92 22.61,26.04 22.61,21.59 26.16,18.03 30.99,18.03 31.88,17.14 31.88,15.88 33.53,14.22 JP2.3
DCMI_HSYNC  (via drill 0.25)
  Top 0.127: X3.18 v18.03,44.07 | U$5.40 8.5,22.85 13.27,27.62 14.16,27.62 15.24,28.7 v16.64,28.7
  Bottom 0.127: v16.64,28.7 16.64,29.97 18.48,31.81 18.8,32.13 18.8,32.26 18.8,32.64 20.57,34.42 20.57,38.1 18.03,40.64 18.03,40.77 v18.03,44.07
DCMI_PCLK  (via drill 0.25)
  Top 0.127: X3.14 v19.03,44.07 | U$5.42 9.5,23.21 13.46,27.18 14.35,27.18 15.37,28.19 16.89,28.19 v17.4,28.7
  Bottom 0.127: v19.03,44.07 19.03,41.91 22.14,38.8 22.14,36.87 21.08,35.81 21.08,34.29 19.18,32.39 19.18,31.75 17.4,29.97 v17.4,28.7
DCMI_PWDN
  Top 0.127: X3.25 16.03,36.93 18.03,34.92 18.03,33.15 17.5,32.61 U$5.123
DCMI_RST  (via drill 0.25)
  Top 0.127: X3.21 17.03,37.34 17.03,36.95 18.31,35.67 20.55,35.67 v23.08,33.15 | U$5.102 25.33,26.07 23.71,27.69 v23.08,27.69
  Bottom 0.127: v23.08,27.69 22.95,27.81 22.95,27.94 22.95,33.02 v23.08,33.15
DCMI_VSYNC  (via drill 0.25)
  Top 0.127: X3.16 v18.53,43.64 | U$5.137 10.5,32.13 12.5,34.13 v15.55,34.13 | v21.59,37.21 21.55,37.17 20.45,37.17 v20.03,37.59
  Bottom 0.127: v15.55,34.13 17.38,35.96 17.38,36.7 18.09,37.41 18.27,37.59 19.01,37.59 19.43,37.59 19.81,37.59 v20.03,37.59 | v18.53,43.64 18.53,41.29 21.59,38.23 v21.59,37.21
DRAM_A0  (via drill 0.25)
  Top 0.127: U$5.10 5.76,24.57 7.22,26.04 7.49,26.04 v8,26.54
  Bottom 0.127: v8,26.54 8,28.19 8.6,28.79 U$7.23
DRAM_A1  (via drill 0.25)
  Top 0.127: U$5.11 5.04,24.12 5.83,24.12 7.24,25.53 v7.75,25.53
  Bottom 0.127: v7.75,25.53 7.75,26.04 7.49,26.29 7.49,28.45 8.63,29.59 U$7.24
DRAM_A2  (via drill 0.25)
  Top 0.127: v7.24,24.89 5.92,23.57 U$5.12
  Bottom 0.127: v7.24,24.89 7.24,25.27 7.11,25.4 7.11,28.82 8.69,30.39 U$7.25
DRAM_A3  (via drill 0.25)
  Top 0.127: v6.73,23.5 6.31,23.07 U$5.13
  Bottom 0.127: U$7.26 8.58,31.19 6.73,29.34 v6.73,23.5
DRAM_A4  (via drill 0.25)
  Top 0.127: v18.03,29.84 14.99,29.84 13.65,28.51 12.89,28.51 6.95,22.57 U$5.14
  Bottom 0.127: U$7.29 19.43,31.19 18.09,29.84 v18.03,29.84
DRAM_A5  (via drill 0.25)
  Top 0.127: U$5.15 7.08,22.07 13.08,28.07 13.97,28.07 15.24,29.34 18.33,29.34 18.8,29.81 v18.8,29.84
  Bottom 0.127: v18.8,29.84 19.34,30.39 U$7.30
DRAM_A6  (via drill 0.25)
  Top 0.127: U$5.50 13.5,10.67 12.57,11.59 12.57,24.79 15.68,27.9 17.36,27.9 v18.16,28.7
  Bottom 0.127: U$7.31 19.98,29.46 19.3,29.46 19.05,29.21 18.67,29.21 v18.16,28.7
DRAM_A7  (via drill 0.25)
  Top 0.127: U$5.53 15,10.67 13.09,12.57 13.08,12.57 13.08,24.73 15.88,27.52 17.74,27.52 v18.92,28.7
  Bottom 0.127: U$7.32 20.02,28.7 v18.92,28.7
DRAM_A8  (via drill 0.25)
  Top 0.127: U$5.54 15.5,10.79 13.59,12.7 13.59,24.62 16.12,27.15 18.13,27.15 v18.92,27.94
  Bottom 0.127: U$7.33 20.06,27.94 v18.92,27.94
DRAM_A9  (via drill 0.25)
  Top 0.127: U$5.55 16,11.05 14.1,12.95 14.1,24.48 16.42,26.81 18.55,26.81 v18.92,27.18
  Bottom 0.127: U$7.34 20.09,27.18 v18.92,27.18
DRAM_A10  (via drill 0.25)
  Top 0.127: v14.86,22.71 14.86,21.97 14.86,12.94 16.5,11.3 U$5.56
  Bottom 0.127: U$7.22 9.58,27.99 v14.86,22.71
DRAM_A11  (via drill 0.25)
  Top 0.127: U$5.57 17,11.56 15.37,13.19 15.37,24.89 16.89,26.42 v18.92,26.42
  Bottom 0.127: U$7.35 18.95,26.39 v18.92,26.42
DRAM_A12  (via drill 0.25)
  Top 0.127: U$5.87 25.4,18.57 v23.75,18.57
  Bottom 0.127: U$7.36 20.89,25.59 21.72,24.77 21.72,20.6 v23.75,18.57
DRAM_BA0  (via drill 0.25)
  Top 0.127: v17.65,21.08 21.34,21.08 22.85,19.57 U$5.89
  Bottom 0.127: v17.65,21.08 15.11,21.08 9.8,26.39 U$7.20
DRAM_BA1  (via drill 0.25)
  Top 0.127: U$5.90 25.4,20.07 25.27,19.94 23.11,19.94 20.95,22.1 v17.65,22.1
  Bottom 0.127: v17.65,22.1 14.73,22.1 9.64,27.19 U$7.21
DRAM_CAS  (via drill 0.25)
  Top 0.127: U$5.132 13,29.34 13,29.25 8.89,25.15 8.85,25.15 v8.09,24.39
  Bottom 0.127: U$7.17 8.49,23.99 v8.09,24.39
DRAM_CLK  (via drill 0.25)
  Top 0.127: v21.21,23.11 22.75,21.57 U$5.93
  Bottom 0.127: U$7.38 20.71,23.99 21.21,23.5 v21.21,23.11
DRAM_CLKE  (via drill 0.25)
  Top 0.127: U$5.45 11,10.84 11.51,11.35 11.51,24.46 13.08,26.04 v13.21,26.04
  Bottom 0.127: v13.21,26.04 13.34,26.04 15.24,24.13 18.75,24.13 19.41,24.79 U$7.37
DRAM_CS  (via drill 0.25)
  Top 0.127: v11.01,24 11.01,11.73 10.5,11.22 U$5.44
  Bottom 0.127: R8.2 7.55,23.31 7.55,24.57 8.57,25.59 U$7.19 9.91,25.59 11.01,24.49 v11.01,24
DRAM_D0  (via drill 0.25)
  Top 0.127: U$5.85 25.02,17.57 24.89,17.57 23.45,17.57 20.95,20.07 18.96,20.07 v18.58,19.68
  Bottom 0.127: v18.58,19.68 18.58,13.34 17.23,11.99 U$7.2
DRAM_D1  (via drill 0.25)
  Top 0.127: v18.03,20.19 18.41,20.57 20.99,20.57 23.5,18.07 U$5.86
  Bottom 0.127: v18.03,20.19 18.03,14.22 17.4,13.59 U$7.4
DRAM_D2  (via drill 0.25)
  Top 0.127: U$5.114 22,28.98 20.77,27.75 20.77,26.8 19.56,25.59 17.54,25.59 16.59,24.64 16.59,15.06 v16,14.48
  Bottom 0.127: U$7.5 15.91,14.39 v16,14.48
DRAM_D3  (via drill 0.25)
  Top 0.127: U$5.115 21.5,29.12 20.38,28 20.38,26.86 19.49,25.97 17.21,25.97 16,24.77 16,16.09 v15.91,16
  Bottom 0.127: U$7.7 v15.9,15.99 v15.91,16
DRAM_D4  (via drill 0.25)
  Top 0.127: U$5.58 17.5,16 17.5,16.41 v17.14,16.76
  Bottom 0.127: U$7.8 17.12,16.79 v17.14,16.76
DRAM_D5  (via drill 0.25)
  Top 0.127: U$5.59 18,17.43 v17.14,18.29
  Bottom 0.127: U$7.10 17.04,18.39 v17.14,18.29
DRAM_D6  (via drill 0.25)
  Top 0.127: U$5.60 18.5,17.82 v17.14,19.18
  Bottom 0.127: U$7.11 v17.13,19.19 v17.14,19.18
DRAM_D7  (via drill 0.25)
  Top 0.127: U$5.63 20,11.18 20,17.21 v17.14,20.07
  Bottom 0.127: U$7.13 10.25,20.79 10.88,20.16 17.06,20.16 v17.14,20.07
DRAM_D8  (via drill 0.25)
  Top 0.127: U$5.64 20.5,17.73 v19.05,19.18
  Bottom 0.127: U$7.42 19.43,20.79 19.05,20.41 v19.05,19.18
DRAM_D9  (via drill 0.25)
  Top 0.127: v21.12,19.05 21.12,17.91 21,17.78 U$5.65
  Bottom 0.127: U$7.44 20.98,19.19 v21.12,19.05
DRAM_D10  (via drill 0.25)
  Top 0.127: U$5.66 21.5,17.62 21.62,17.75 v21.62,18.67
  Bottom 0.127: U$7.45 21.35,18.39 v21.62,18.67
DRAM_D11  (via drill 0.25)
  Top 0.127: v22.12,18.29 22,18.16 U$5.67
  Bottom 0.127: U$7.47 20.63,16.79 v22.12,18.29
DRAM_D12  (via drill 0.25)
  Top 0.127: U$5.68 22.5,17.67 v22.61,17.78
  Bottom 0.127: U$7.48 20.82,15.99 v22.61,17.78
DRAM_D13  (via drill 0.25)
  Top 0.127: U$5.77 24.02,13.57 v24,13.59
  Bottom 0.127: U$7.50 21.38,14.39 22.18,13.59 v24,13.59
DRAM_D14  (via drill 0.25)
  Top 0.127: U$5.78 23.88,14.07 23.5,13.69 v23.5,13.08
  Bottom 0.127: U$7.51 21.34,13.59 21.84,13.08 v23.5,13.08
DRAM_D15  (via drill 0.25)
  Top 0.127: U$5.79 23.71,14.57 22.99,13.84 v22.99,12.45
  Bottom 0.127: v22.99,12.45 22.53,11.99 U$7.53
DRAM_DQMH  (via drill 0.25)
  Top 0.127: v9.27,32.89 8.68,32.89 8,32.21 U$5.142
  Bottom 0.127: v9.27,32.89 9.7,32.89 10.03,32.56 10.03,28.07 14.91,23.19 U$7.39
DRAM_DQML  (via drill 0.25)
  Top 0.127: U$5.141 8.5,30.09 8.13,29.72 v5.84,29.72
  Bottom 0.127: v5.84,29.72 5.59,29.46 5.59,22.23 6.03,21.78 6.1,21.72 7.37,21.72 8.04,22.39 U$7.15
DRAM_RAS  (via drill 0.25)
  Top 0.127: v12.06,21.97 12.06,11.43 13,10.5 U$5.49
  Bottom 0.127: v12.06,21.97 12.06,22.23 9.5,24.79 U$7.18
DRAM_WE  (via drill 0.25)
  Top 0.127: U$5.43 10,11.6 10.25,11.86 v10.25,22.73
  Bottom 0.127: U$7.16 9.79,23.19 v10.25,22.73
FS_DM
  Top 0.203: X1.2 26.02,5.21 28.07,7.25 28.07,25.78 27.75,26.1 27.28,26.57 U$5.103
FS_DP
  Top 0.203: X1.3 26.67,5.21 28.57,7.11 28.57,25.91 27.41,27.07 U$5.104
GND  (via drill 0.25, 0.33, 0.41)
  Top 0.127: Y2.2 1.13,26.62 C22.1 | Y2.4 2.98,22.2 C21.1 | RN2.6 v30.88,24.51 | v19,34.29 U$5.120
  Top 0.254: X3.19 v17.53,37.59 | X3.27 v15.53,37.59 | X3.5 v21.03,37.59 | U$5.31 5.84,14.07 5.87,14.07 6.35,13.59 v6.35,12.95 | C20.2 v26.16,10.67 | U$5.107 28.99,28.57 C19.2 29.04,28.96 v29.04,29.8 | C11.2 27.7,32.4 v27.05,31.75 | C10.2 v5.97,33.15 | R2.1 v10.79,35.77 | v10.79,37.2 C13.2 | v14,10.83 U$5.51 14,8.64 13.78,8.42 v12.7,8.42 | U$5.61 19,9.78 | 19,9.78 v19,11.05 | U$5.83 25.21,16.57 v25.15,16.51 | U$5.130 v14,29.72 | U$5.16 3.79,21.57 3.26,22.1 C21.1 2.88,21.97 3.2,21.66 3.2,21.27 v3.33,21.14 | U$5.38 v7.5,8.42 | U$5.94 v23.88,22.07 | U$5.120 v19,34.29 | v17.78,8.42 17.8,8.44 18.74,8.44 19,8.7 19,9.78 | C16.2 33.87,22.86 v34.55,22.86
  Top 0.406: Q1.2 9.68,35.88 R2.1
  Top 0.55: U8.2 v15.11,4.57
  Top 0.61: C1.C v25.65,41.66
  Bottom 0.127: 18.98,34.3 v19,34.29
  Bottom 0.254: C17.2 5.92,9.19 v6.35,8.76 | C14.2 26.16,9.79 v26.16,10.67 | v25.15,16.51 24.64,16.51 24.14,16.02 C23.2 C26.2 | U$7.46 v19.05,17.59 v19.04,17.58 | U$7.52 v19.05,12.79 19.05,11.1 v19,11.05 19.14,11.19 U$7.54 | U$7.41 v19.05,21.59 | C24.2 4.43,19.3 5.12,19.99 v8,19.99 U$7.12 | U$7.28 v20.11,32.6 | U$7.6 v8.08,15.19 | C27.2 18.98,34.3 | C15.2 13.12,8 v12.7,8.42 | C12.2 18.2,8 v17.78,8.42 | C25.2 9.98,35.77 v10.79,35.77 | X2.G$3 24.72,31.75 v24.99,31.75 | X2.G$1 v34.55,22.86 | X2.G$2 34.33,32.77 33.4,31.85 v33.4,31.75 | X2.G$4 23.85,25.98 v23.44,26.39 | X2.CD$2 28.52,22.34 v29.08,22.9 | C9.C 5.97,34.42 v5.97,33.15
  other vias: 28.83,5.46 27.94,5.46 14.22,4.57 16.13,4.57 17.91,3.68 17.14,3.68 11.05,5.33 25.78,34.67 27.94,36.83 26.67,36.83 24,34.67 11.05,4.19 11.05,6.48 32.64,29.46 0.38,27.56 2.03,27.56 3.68,27.56 0.64,21.08
  pour GND (isolate 0.305): 0,0 0,44.45 35.56,44.45 35.56,0
  pour Top (isolate 0.254, rank 5, no thermals): 27.27,3.49 27.27,7.36 30.69,7.36 30.69,3.49
  pour Top (isolate 0.254, rank 3, no thermals): 10.41,6.99 18.29,6.99 18.29,2.03 16.89,2.03 16.89,3.05 16.89,4.19 11.94,4.19 11.94,2.79 10.41,2.79
  pour Top (isolate 0.254, rank 5, no thermals): 22.99,37.08 30.35,37.08 30.35,33.78 22.99,33.78
  pour Top: 0,27.81 3.94,27.81 3.94,20.83 0,20.83
  pour Bottom: 5.08,15.88 9.78,15.88 9.78,13.46 5.08,13.46
  pour Bottom: 35.31,30.1 31.37,30.1 31.37,28.96 35.31,28.96
  pour Top: 31.37,30.1 35.31,30.1 35.31,28.19 31.37,28.19
I2C1_SCL  (via drill 0.25)
  Top 0.127: X3.32 14.53,43.69 v14.15,44.07 10.54,44.07 9.02,42.55 R3.2 | U$5.139 9.5,31.85 v13.39,35.74
  Bottom 0.127: v14.15,44.07 14.53,43.68 14.53,39.55 13.39,38.41 v13.39,35.74
I2C1_SDA  (via drill 0.25)
  Top 0.127: X3.34 14.03,43.26 v13.65,43.64 11.51,43.64 10.54,42.67 R4.2 | v12.89,36.13 12.89,35.75 9.21,32.07 9,31.86 U$5.140
  Bottom 0.127: v12.89,36.13 12.89,38.35 13.78,39.24 13.78,40.26 13.78,43.51 v13.65,43.64
I2C2_SCL
  Top 0.127: U$5.69 23,8.77 22.23,8 2.79,8 JP1.5
I2C2_SDA
  Top 0.127: JP1.6 2.67,7.62 22.35,7.62 23.5,8.77 U$5.70
LED_B  (via drill 0.25)
  Top 0.127: U$5.28 6.55,15.57 v6.73,15.75
  Bottom 0.127: v6.73,15.75 6.22,15.24 R11.1
LED_G  (via drill 0.25)
  Top 0.127: U$5.27 6.22,16.07 6.73,16.58 v6.73,16.76
  Bottom 0.127: v6.73,16.76 6.48,16.51 R12.1
LED_IR
  Top 0.127: U$5.1 4.74,29.07 4.7,29.11 R7.1
LED_R  (via drill 0.25)
  Top 0.127: U$5.26 5.9,16.57 6.73,17.4 v6.73,17.78
  Bottom 0.127: R10.1 v6.73,17.78
N$1  (via drill 0.25)
  other vias: 3.05,43.43
N$3  (via drill 0.25)
  other vias: 5.08,41.4
N$5
  Top 0.127: R7.2 4.7,32.64 6.04,33.98 Q1.1
  Top 0.406: Q1.1 8.21,34.08 R2.2
N$6  (via drill 0.25)
  Top 0.127: LED1.B v2.86,30.48
  Bottom 0.127: R11.2 4.18,15.24 3.3,16.11 3.3,17.65 2.92,18.03 2.92,20.07 4.45,21.59 4.45,28.89 v2.86,30.48
N$7
  pour Top (isolate 0.254, rank 2, no thermals): 24.64,6.99 23.37,6.99 23.37,3.53 24.77,3.53 25.48,3.53 25.48,6.99
N$8  (via drill 0.25)
  Top 0.127: LED1.R v1.46,29.59
  Bottom 0.127: v1.46,29.59 1.02,29.59 0.51,30.1 0.51,30.73 1.4,31.62 3.68,31.62 5.21,30.1 5.21,21.21 3.68,19.68 3.68,18.4 4.3,17.78 R10.2
N$9  (via drill 0.25)
  Top 0.127: LED1.G v1.46,30.48
  Bottom 0.127: R12.2 4.05,16.51 3.68,16.88 3.68,17.78 3.3,18.16 3.3,19.94 4.83,21.46 4.83,29.59 3.17,31.24 2.22,31.24 v1.46,30.48
N$10
  Top 0.406: LED3.C 7.83,39.81 R1.2
N$11
  Top 0.61: C6.1 27.97,34.55 U5.4
N$13
  Top 0.406: R5.2 R6.1 U8.4
N$14
  Top 0.406: R1.1 6.01,37.6 Q1.3
N$15  (via drill 0.25)
  other vias: 1.02,41.4
N$16  (via drill 0.25)
  other vias: 3.05,39.37
N$17  (via drill 0.41)
  Top 0.406: v27,43.51 28.22,43.51 LED2.C | LED3.A 8.94,43.41 v8.97,43.38
  VCC 0.406: v24,42.55 23.5,42.04 12.19,42.04 v11.68,42.55
  Bottom 0.406: v11.68,42.55 9.8,42.55 v8.97,43.38 | v24,42.55 24.97,43.51 v27,43.51
N$18  (via drill 0.25)
  other vias: 4.45,42.8
N$19  (via drill 0.25)
  other vias: 1.65,42.8
N$20  (via drill 0.25)
  other vias: 1.65,40.01
N$21  (via drill 0.25)
  other vias: 4.45,40.01
N$22  (via drill 0.25)
  other vias: 32.51,43.43
N$23  (via drill 0.25)
  other vias: 30.48,41.4
N$24  (via drill 0.25)
  other vias: 34.54,41.4
N$25  (via drill 0.25)
  other vias: 32.51,39.37
N$26  (via drill 0.25)
  other vias: 31.11,42.8
N$27  (via drill 0.25)
  other vias: 31.11,40.01
N$28  (via drill 0.25)
  other vias: 33.91,42.8
N$29  (via drill 0.25)
  other vias: 33.91,40.01
N$30
  Top 0.127: U$5.24 4.27,17.57 3.3,18.54 3.3,19.72 1.18,21.84 1.18,21.97 | 1.18,21.97 C21.2 | Y2.3 1.18,23.58 1.18,21.97
N$31
  Top 0.127: U$5.23 4.28,18.07 3.68,18.67 3.68,19.94 2.03,21.59 2.03,24.38 2.83,25.18 Y2.1 2.98,26.57 C22.2
N$35  (via drill 0.25)
  Top 0.254: v3.68,13.97 3.68,13.59 | 3.68,13.59 3.68,13.21 3.68,13.08 | U$5.32 3.7,13.57 3.68,13.59 | 3.68,13.08 3.68,11.43 3.68,11.3 U3.1 4.75,9.95 v4.13,9.34 | U$5.33 3.69,13.07 3.68,13.08
  Bottom 0.254: C18.1 v3.68,13.97 | C17.1 4.62,9.83 v4.13,9.34
NRST  (via drill 0.25)
  Top 0.127: U$5.25 3.48,17.07 2.92,16.51 2.92,11.3 v3.05,11.18 | JP3.4 31.88,13.46 31.88,17.27 JP2.1 33.02,20.19 C16.1 32.95,22.09 RN2.4
  Bottom 0.127: v3.05,11.18 4.95,11.18 7.18,8.95 27.4,8.95 30.1,11.65 JP3.4
RAW
  pour Top (isolate 0.254, rank 2, no thermals): 21.84,4.32 21.84,0.25 20.19,0.25 20.19,3.84 18.41,3.84 18.41,5.31 13.94,5.31 13.94,6.99 19.43,6.99 19.43,4.32
SD_CD  (via drill 0.25)
  Top 0.127: RN2.1 29.28,21.79 29.59,21.48 v29.59,21.08 | U$5.92 25.52,21.07 v24.89,20.45
  Bottom 0.127: v29.59,21.08 29.59,20.83 29.21,20.45 v24.89,20.45 24.82,20.51 X2.CD$1
SDIO_CLK  (via drill 0.25)
  Top 0.127: U$5.113 22.5,30.21 23.37,29.34 25.27,29.34 25.65,29.72 26.67,29.72 v27.27,29.72
  Bottom 0.127: X2.P$5 28.67,28.44 27.39,29.72 v27.27,29.72
SDIO_CMD  (via drill 0.25)
  Top 0.127: U$5.116 21,31.88 21.51,32.38 v23.5,32.38 | v29.08,32.13 29.08,31.88 29.08,31.75 29.08,31.37 29.08,30.35 30.1,29.34 30.1,26.16 30.08,26.14 | RN2.7 30.08,26.14 | 30.08,26.14 v30.06,26.16
  Bottom 0.127: v23.5,32.38 25.02,32.38 27.3,32.38 28.83,32.38 v29.08,32.13 | X2.P$3 34.59,26.16 v30.06,26.16
SDIO_D0  (via drill 0.25)
  Top 0.127: U$5.98 v24.89,24.07 | RN3.8 32.95,30.41 v32.64,30.1
  Bottom 0.127: 32.64,30.64 32.26,30.64 29.84,30.64 27.59,30.64 26.16,29.21 26.16,27.18 26.16,24.38 25.85,24.07 v24.89,24.07 | 32.64,30.64 X2.P$7 | 32.64,30.64 v32.64,30.1
SDIO_D1  (via drill 0.25)
  Top 0.127: U$5.99 25.4,24.57 v25.15,24.82 | RN3.7 v32.15,31.75
  Bottom 0.127: v25.15,24.82 25.15,28.7 27.5,31.06 29.97,31.06 32.13,31.06 | X2.P$8 34.29,31.69 33.66,31.06 32.13,31.06 | X2.P$8 35.18,31.69 X2.P$8 | v32.15,31.75 32.15,31.08 32.13,31.06
SDIO_D2  (via drill 0.25)
  Top 0.127: U$5.111 23.5,30.22 23.75,29.97 24.89,29.97 25.53,30.61 25.53,32.38 25.91,32.77 26.54,33.4 30.9,33.4 31.35,32.95 RN3.3 31.35,32.11 30.99,31.75 30.23,31.75 29.97,31.5 29.97,30.48 30.86,29.59 30.86,26.39 31.35,25.91 32.38,25.91 33.53,24.77 v33.53,24.72
  Bottom 0.127: X2.P$1 34.21,24.04 v33.53,24.72
SDIO_D3  (via drill 0.25)
  Top 0.127: U$5.112 23,30.21 23.62,29.59 24.89,29.59 25.78,30.48 25.78,31.75 25.78,32.26 26.61,33.08 29.99,33.08 RN3.4 30.3,32.52 29.59,31.82 29.59,30.35 30.48,29.46 30.48,25.91 v31.24,25.15
  Bottom 0.127: X2.P$2 v31.25,25.14 v31.24,25.15
SPI2_MISO  (via drill 0.25)
  Top 0.127: U$5.75 v24.77,12.57
  Bottom 0.127: JP1.2 1.65,16 2.92,14.73 2.92,13.46 3.94,12.45 5.21,12.45 5.33,12.32 7.62,10.03 24.13,10.03 24.38,10.29 24.38,12.19 v24.77,12.57
SPI2_MOSI  (via drill 0.25)
  Top 0.127: U$5.76 v24.38,13.07
  Bottom 0.127: JP1.1 1.65,18.67 2.86,17.46 2.86,15.3 3.24,14.92 3.24,13.59 4.06,12.76 5.4,12.76 7.75,10.41 23.24,10.41 23.75,10.92 23.75,12.44 v24.38,13.07
SPI2_NSS  (via drill 0.25)
  Top 0.127: U$5.73 25.53,11.57 v25.27,11.32
  Bottom 0.127: JP1.4 4.95,11.68 6.99,9.65 7.37,9.27 24.51,9.27 25.27,10.03 v25.27,11.32
SPI2_SCLK  (via drill 0.25)
  Top 0.127: U$5.74 v25.15,12.07
  Bottom 0.127: JP1.3 3.81,12.06 5.08,12.06 7.49,9.65 24.26,9.65 24.77,10.16 24.77,11.69 v25.15,12.07
SPI3_MISO  (via drill 0.25)
  Top 0.127: U$5.134 12,31.88 13.05,32.92 | 13.05,32.92 v14.51,32.92 13.05,32.92 | X3.15 18.54,38.83 v18.54,36.12
  Bottom 0.127: v18.54,36.12 18.54,35.99 15.47,32.92 v14.51,32.92
SPI3_MOSI  (via drill 0.25)
  Top 0.127: U$5.135 11.5,31.88 13.13,33.51 v15.07,33.51 | v18.02,36.69 v18.03,36.7 X3.17
  Bottom 0.127: v15.07,33.51 15.58,33.51 18.02,35.95 v18.02,36.69 | v18.02,36.69
SPI3_SCLK/TRACESWO  (via drill 0.25)
  Top 0.127: X3.13 19.03,37.1 v19.05,37.08 | U$5.133 12.5,31.88 13.01,32.38 v13.97,32.38 | v19.68,34.29 20.95,33.02 v22.1,33.02
  Bottom 0.127: v13.97,32.38 v13.98,32.38 15.45,32.38 16.72,33.66 19.05,33.66 v19.68,34.29 19.68,36.45 v19.05,37.08 | JP3.1 25.4,19.3 22.86,21.84 22.86,26.29 22.1,27.05 v22.1,33.02
SPI3_SSEL
  Top 0.127: X3.11 19.53,37.47 22.47,34.53 24,33 U$5.110
SW
  pour Top (isolate 0.254, no thermals): 15.62,3.81 16.51,3.81 16.51,0.25 15.62,0.25
SWCLK  (via drill 0.25)
  Top 0.127: v21.3,27.56 22.57,28.83 v24.51,28.83 | U$5.109 v25.02,31.07
  Bottom 0.127: JP3.2 26.8,16.76 22.35,21.21 22.35,25.78 21.3,26.84 v21.3,27.56 | v25.02,31.07 25.02,29.34 v24.51,28.83
SWDIO  (via drill 0.25)
  Top 0.127: v21.64,25.65 21.64,27.05 22.78,28.19 23.75,28.19 24.38,27.56 26.49,27.56 U$5.105
  Bottom 0.127: JP3.3 28.7,14.22 22.02,20.9 22.02,25.15 21.64,25.53 v21.64,25.65
TIM4_CH1  (via drill 0.25)
  Top 0.127: U$5.81 25.6,15.57 v25.15,15.11
  Bottom 0.127: v25.15,15.11 25.15,14.67 27.01,12.8 30.66,12.8 31.75,11.71 31.75,9.34 33.91,7.18 JP2.6
TIM4_CH2  (via drill 0.25)
  Top 0.127: U$5.82 25.47,16.07 v25.15,15.75
  Bottom 0.127: JP2.5 33.91,10.03 30.86,13.08 27.81,13.08 v25.15,15.75
VBUS
  Top 0.203: U$5.101 27.39,25.57 27.56,25.4 27.56,7.75 27.05,7.24 23.08,7.24 L2.2
  pour Top (isolate 0.254, rank 3, no thermals): 19.81,5.59 21.72,5.59 21.72,6.99 22.86,6.99 22.86,5.21 21.84,5.21 21.84,4.7 19.81,4.7
VCAP1
  Top 0.127: 29.17,27.13 C19.1
  Top 0.254: U$5.106 27.98,28.07 28.91,27.13 29.17,27.13
VCAP2
  Top 0.254: C20.1 25.78,7.66 24.85,7.66 24,8.51 U$5.71
VCC  (via drill 0.25, 0.33, 0.41)
  Top 0.127: LED1.A v2.86,29.59 | 6.35,10 6.35,10.54 7.11,11.3 | RN3.2 v32.15,33.27 | RN3.1 v32.95,33.27 | RN3.6 31.35,30.59 31.84,30.1 v31.88,30.1 | v31.11,30.1 31.05,30.1 30.55,30.59 RN3.5 | RN2.5 v31.68,24.51 | RN2.2 30.08,21.48 v30.48,21.08 | 7.5,30.1 6.99,30.1 6.22,30.1 | v27.94,30.23 v27.94,30.22 | RN2.8 v29.28,24.51
  Top 0.254: X3.30 15.03,43.81 v14.9,43.94 | X3.10 20.03,43.4 20.28,43.65 v20.28,43.94 | U5.3 24.51,35.88 24.51,37.78 U5.1 | U$5.30 6.19,14.57 v6.6,14.99 | U$5.17 v7.62,21.07 | U3.2 6.35,10 6.35,10.54 7.11,11.3 v7.49,11.3 8,10.8 8,10.54 U$5.39 | v24.93,8.41 24.9,8.41 24.5,8.81 U$5.72 | U$5.108 27.56,29.07 27.94,29.45 v27.94,30.22 | C11.1 v27.94,30.23 | U$5.144 7,30.11 6.99,30.1 | C10.1 5.97,30.35 6.22,30.1 7.5,30.1 U$5.143 7.5,32.39 v7.62,32.51 | C13.1 v10.79,38.5 10.79,40.04 R4.1 R3.1 | U$5.84 v24.13,17.07 | U$5.131 v13.5,29.21 | U$5.6 6.15,26.57 v6.22,26.57 | v15.75,8.42 15.73,8.44 14.76,8.44 14.5,8.7 U$5.52 | v20.83,8.42 19.78,8.42 19.5,8.7 U$5.62 | U$5.95 v25.02,22.57 | v18.03,32.26 18.18,32.26 18.5,31.94 U$5.121
  Top 0.305: X3.20 v17.53,43.64
  Top 0.61: LED2.A v28.32,39.12
  Bottom 0.254: C14.1 25.27,8.37 24.97,8.37 v24.93,8.41 | U$7.43 21.34,19.99 23.1,18.23 23.1,17.14 23.1,17.02 | C24.1 v6.73,19.05 | 23.1,17.02 23.1,16.26 C23.1 C26.1 22.1,14.73 21.64,15.19 U$7.49 | v24.13,17.07 23.15,17.07 23.1,17.02 | C15.1 14.91,8.04 15.37,8.04 v15.75,8.42 | C12.1 19.99,8.04 20.45,8.04 v20.83,8.42 | U$7.27 8.86,31.99 8.53,32.31 8.53,33.41 9.4,34.27 C25.1 | C27.1 v18.03,32.26
  other vias: 25.27,38.86 24.13,38.86 22.99,43.81 22.99,42.93 12.95,43.18 13.21,0.51 12.45,0.51 11.56,0.51 10.67,0.51 32.77,27.69 33.4,27.69
  pour VCC (isolate 0.305): 0.38,0.38 0.38,44.07 35.18,44.07 35.18,0.38
  pour Top (isolate 0.254, no thermals): 2.03,33.02 2.03,30.99 3.81,30.99 3.81,33.02
  pour Top (isolate 0.254, rank 4, no thermals): 14.48,2.29 14.48,0.25 10.41,0.25 10.41,2.29 11.68,2.29
  pour Top (isolate 0.254, no thermals): 21.97,44.2 21.97,42.42 26.42,42.42 26.42,44.2
  pour Top (isolate 0.254, no thermals): 22.99,39.24 25.91,39.24 25.91,37.47 22.99,37.47
  pour Top (isolate 0.254, no thermals): 12.7,43.56 12.7,42.29 13.65,42.29 13.65,43.56
  pour Bottom: 6.1,13.21 9.78,13.21 9.78,10.79 6.1,10.79
  pour Bottom: 5.08,21.97 9.78,21.97 9.78,17.14 5.08,17.14
  pour Bottom: 35.31,27.94 31.24,27.94 31.24,26.8 35.31,26.8
  pour Top: 31.24,27.94 35.31,27.94 35.31,25.78 31.24,25.78
  pour Bottom: 5.46,32.77 9.91,32.77 9.91,31.24 5.46,31.24
VDDA  (via drill 0.41)
  Top 0.33: X3.4 v21.53,43.82
  Bottom 0.61: v26.8,38.86 25.02,40.64 22.86,40.64 21.53,41.97 v21.53,43.82
  other vias: 26.8,37.97
  pour Bottom (isolate 0.254, rank 2, no thermals): 27.62,39.24 26.42,39.24 26.42,37.54 27.62,37.54
  pour Top (isolate 0.254, rank 2, no thermals): 26.42,37.54 30.35,37.54 30.35,38.42 27.62,38.42 27.62,39.24 26.42,39.24
VIN  (via drill 0.33)
  Bottom 1.016: JP2.7 22.99,4.06 21.08,2.16 v18.67,2.16 8.38,2.16 6.11,4.43 X4.1
  other vias: 19.43,2.16
  pour Top (isolate 0.254, no thermals): 16.89,0.25 16.89,1.52 18.41,1.52 18.41,3.45 19.68,3.45 19.68,0.25

### Text on the board
tPlace: P0 | SWO | RST | P1 | SWC | BOOT | P2 | SWD | SYN | P3 | RST | NC | P4 | P8 | 3.3v | P5 | GND | P7 | P6 | VIN | 3.3V | GND
bPlace: https://openmv.io | OpenMV-H7 R2 | 5/21/19 | LED1=Red | LED2=Green | LED3=Blue | LED4=IR | Built by MacroFab | Made in USA | Pin List | P0=PB15/MOSI | P0 | P1=PB14/MISO | P2=PB13/SCLK | SWO | RST | P3=PB12/SS | P1 | P4=PB10/TXD/SCL | SWC | P5=PB11/RXD/SDA | BOOT | P2 | P6=PA5/ADC/DAC | SWD | SYN | P7=PD12/SERVO1 | P3 | P8=PD13/SERVO2 | RST | NC | P9=PD14/SERVO3 | P4 | P8 | Max voltage: 5v | 3.3v | P5 | GND | P7 | P6 | VIN | 3.3V | GND